# Altium project 724452_RPL-HX_Mobile_AEP_Rev0p91.PrjPcb (part 7 of 13)

## Sheet 0045_PCH STRAPS 1.SchDoc
size A3
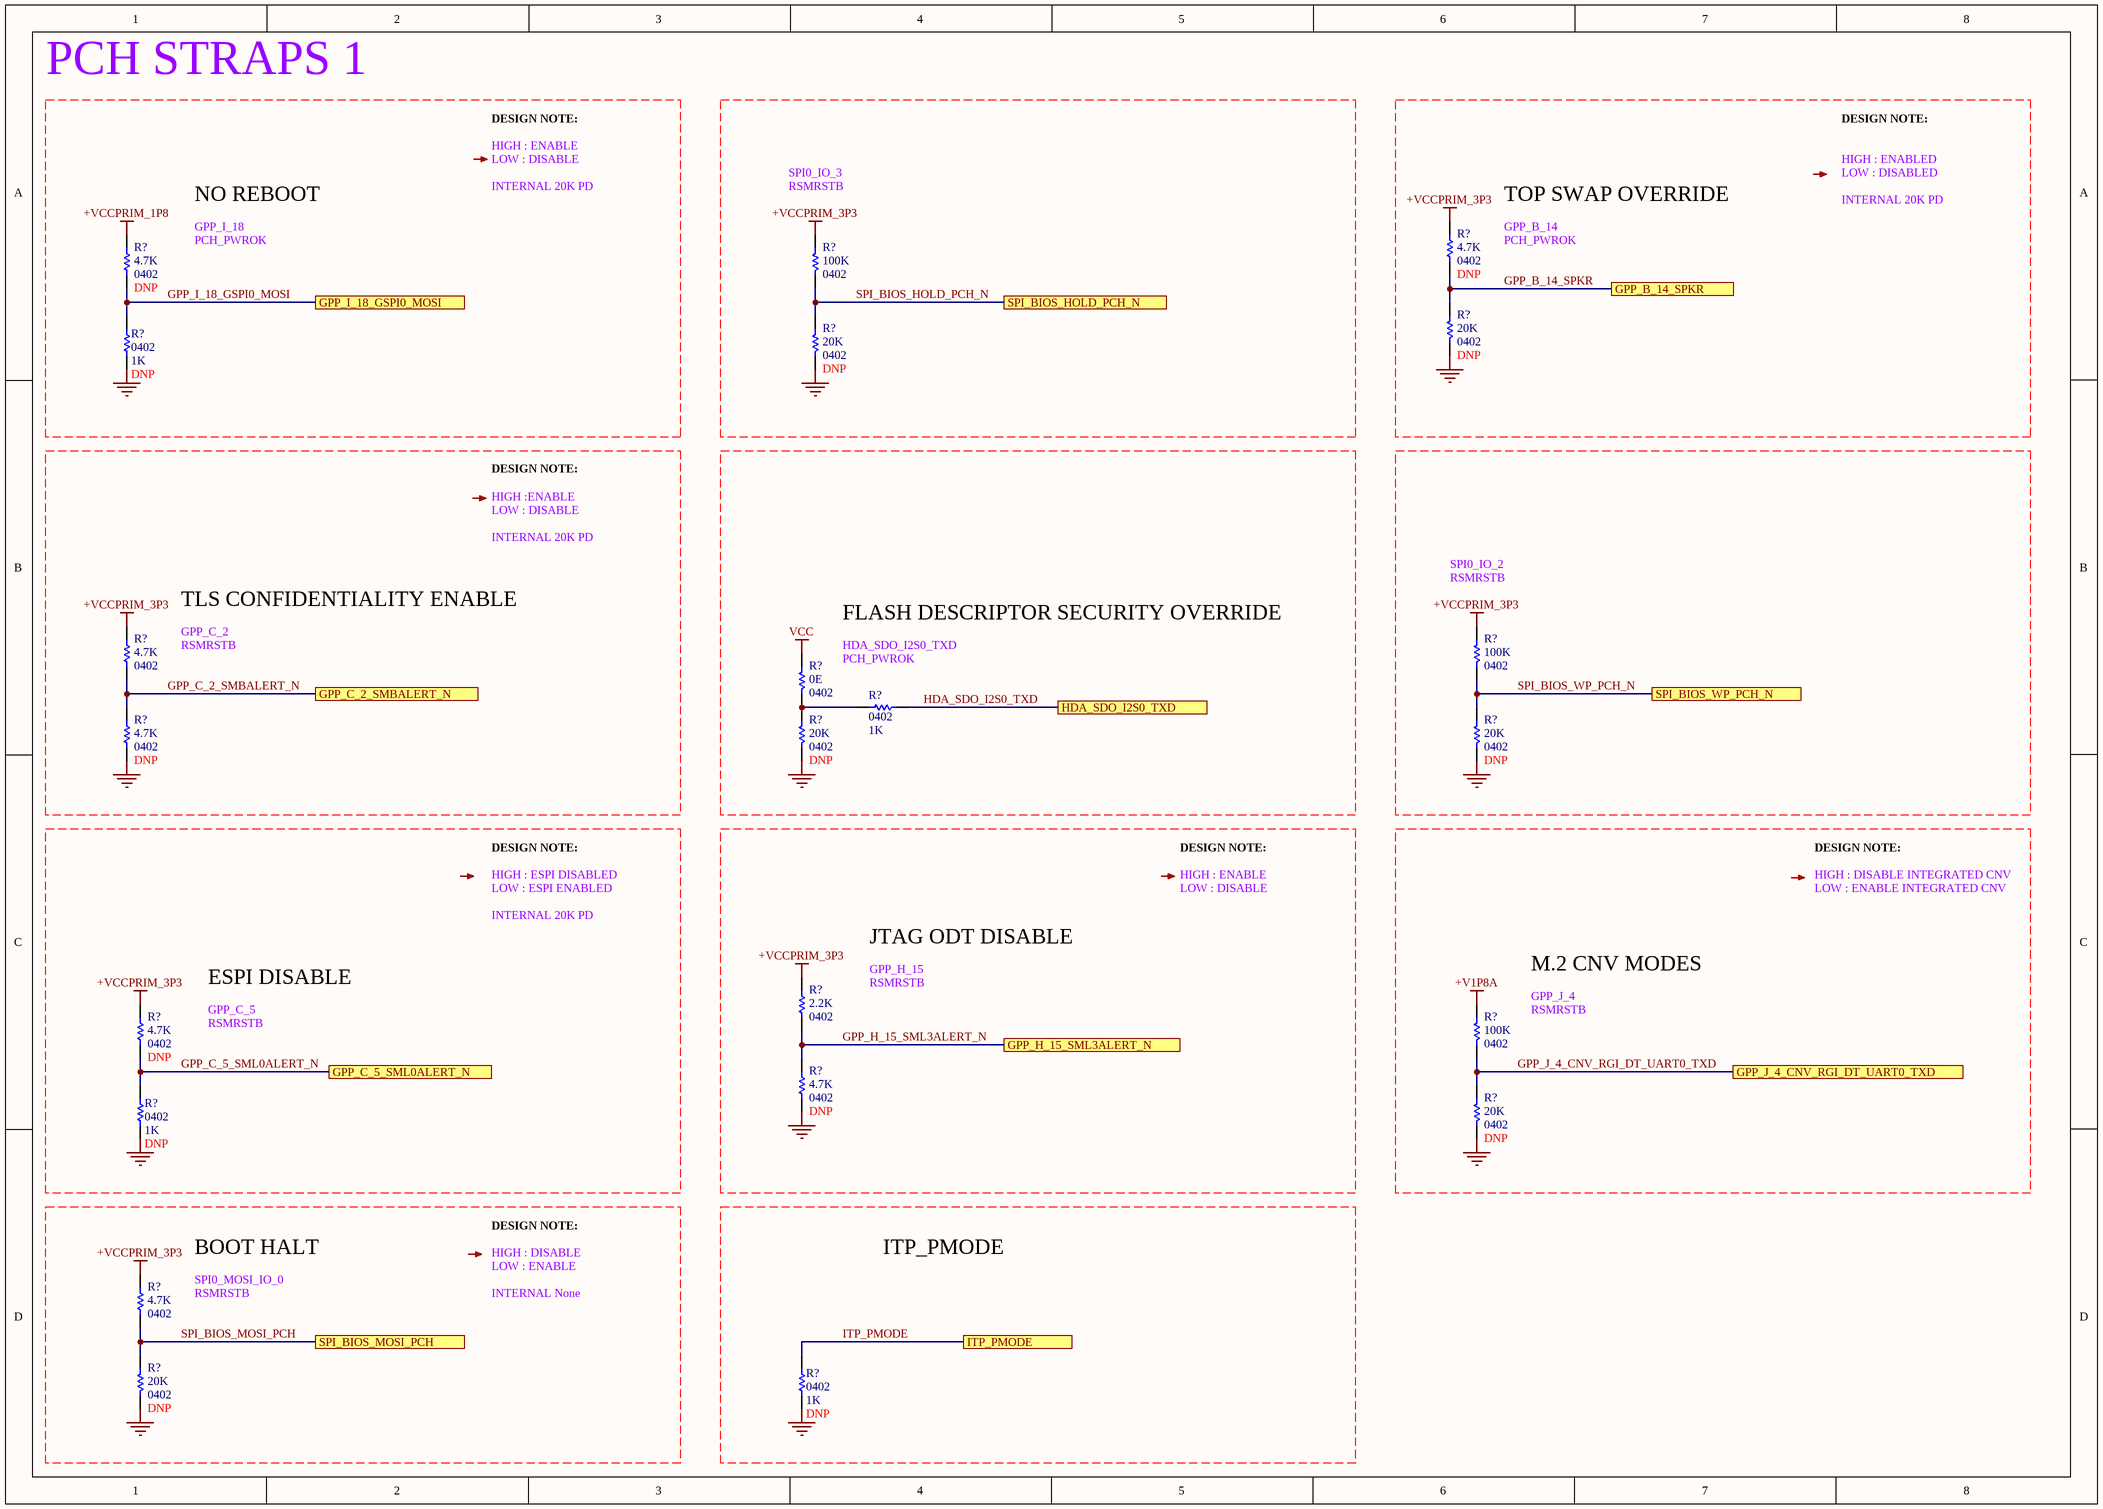
[diagram p76: 0045_PCH STRAPS 1.SchDoc]

### Parts
(Parts that share a designator on the sheet are numbered #1, #2 ... from top to bottom, then left to right.)
R?#184  value 4.7K  Case/Package: 0402  [RESC0402]  (hidden comment: Res)
R?#185  value 4.7K  Case/Package: 0402  [RESC0402]  (hidden comment: Res)
R?#186  value 100K  Case/Package: 0402  [RESC0402]  (hidden comment: Res)
R?#187  value 20K  Case/Package: 0402  [RESC0402]  (hidden comment: Res)
R?#188  value 1K  Case/Package: 0402  [RESC0402]  (hidden comment: Res)
R?#189  value 20K  Case/Package: 0402  [RESC0402]  (hidden comment: Res)
R?#190  value 4.7K  Case/Package: 0402  [RESC0402]  (hidden comment: Res)
R?#191  value 100K  Case/Package: 0402  [RESC0402]  (hidden comment: Res)
R?#192  value 0E  Case/Package: 0402  [RESC0402]  (hidden comment: Res)
R?#193  value 1K  Case/Package: 0402  [RESC0402]  (hidden comment: Res)
R?#194  value 4.7K  Case/Package: 0402  [RESC0402]  (hidden comment: Res)
R?#195  value 20K  Case/Package: 0402  [RESC0402]  (hidden comment: Res)
R?#196  value 20K  Case/Package: 0402  [RESC0402]  (hidden comment: Res)
R?#197  value 2.2K  Case/Package: 0402  [RESC0402]  (hidden comment: Res)
R?#198  value 4.7K  Case/Package: 0402  [RESC0402]  (hidden comment: Res)
R?#199  value 100K  Case/Package: 0402  [RESC0402]  (hidden comment: Res)
R?#200  value 4.7K  Case/Package: 0402  [RESC0402]  (hidden comment: Res)
R?#201  value 1K  Case/Package: 0402  [RESC0402]  (hidden comment: Res)
R?#202  value 20K  Case/Package: 0402  [RESC0402]  (hidden comment: Res)
R?#203  value 4.7K  Case/Package: 0402  [RESC0402]  (hidden comment: Res)
R?#204  value 20K  Case/Package: 0402  [RESC0402]  (hidden comment: Res)
R?#205  value 1K  Case/Package: 0402  [RESC0402]  (hidden comment: Res)

### Ports
GPP_B_14_SPKR, GPP_C_2_SMBALERT_N, GPP_C_5_SML0ALERT_N, GPP_H_15_SML3ALERT_N, GPP_I_18_GSPI0_MOSI, GPP_J_4_CNV_RGI_DT_UART0_TXD, HDA_SDO_I2S0_TXD, ITP_PMODE, SPI_BIOS_HOLD_PCH_N, SPI_BIOS_MOSI_PCH, SPI_BIOS_WP_PCH_N

### Nets
+V1P8A: R?#199.2
+VCCPRIM_1P8: R?#185.2
+VCCPRIM_3P3: R?#184.2 R?#186.2 R?#190.2 R?#191.2 R?#197.2 R?#198.2 R?#203.2
GND: R?#187.1 R?#188.1 R?#189.1 R?#194.1 R?#195.1 R?#196.1 R?#200.1 R?#201.1 R?#202.1 R?#204.1 R?#205.1  [project net EXP_A_RX_4_DP]
VCC: R?#192.2
GPP_B_14_SPKR: R?#184.1 R?#187.2 ; port GPP_B_14_SPKR
GPP_C_2_SMBALERT_N: R?#190.1 R?#194.2 ; port GPP_C_2_SMBALERT_N
GPP_C_5_SML0ALERT_N: R?#198.1 R?#201.2 ; port GPP_C_5_SML0ALERT_N
GPP_H_15_SML3ALERT_N: R?#197.1 R?#200.2 ; port GPP_H_15_SML3ALERT_N
GPP_I_18_GSPI0_MOSI: R?#185.1 R?#188.2 ; port GPP_I_18_GSPI0_MOSI
GPP_J_4_CNV_RGI_DT_UART0_TXD: R?#199.1 R?#202.2 ; port GPP_J_4_CNV_RGI_DT_UART0_TXD
HDA_SDO_I2S0_TXD: R?#193.2 ; port HDA_SDO_I2S0_TXD
ITP_PMODE: R?#205.2 ; port ITP_PMODE
SPI_BIOS_HOLD_PCH_N: R?#186.1 R?#189.2 ; port SPI_BIOS_HOLD_PCH_N
SPI_BIOS_MOSI_PCH: R?#203.1 R?#204.2 ; port SPI_BIOS_MOSI_PCH
SPI_BIOS_WP_PCH_N: R?#191.1 R?#196.2 ; port SPI_BIOS_WP_PCH_N
NetR?#192_1: R?#192.1 R?#193.1 R?#195.2

### Notes on the sheet
- PCH STRAPS 1
- DESIGN NOTE:
- LOW : DISABLE
- HIGH : ENABLE
- SPI0_IO_3
- LOW : DISABLED
- HIGH : ENABLED
- NO REBOOT
- GPP_I_18
- PCH_PWROK
- INTERNAL 20K PD
- RSMRSTB
- GPP_B_14
- TOP SWAP OVERRIDE
- HIGH :ENABLE
- SPI0_IO_2
- TLS CONFIDENTIALITY ENABLE
- GPP_C_2
- FLASH DESCRIPTOR SECURITY OVERRIDE
- (near R?#192) HDA_SDO_I2S0_TXD
- (near R?#193) PCH_PWROK
- HIGH : ESPI DISABLED
- LOW : ESPI ENABLED
- LOW : ENABLE INTEGRATED CNV
- HIGH : DISABLE INTEGRATED CNV
- ESPI DISABLE
- JTAG ODT DISABLE
- GPP_H_15
- M.2 CNV MODES
- GPP_C_5
- GPP_J_4
- BOOT HALT
- HIGH : DISABLE
- ITP_PMODE
- SPI0_MOSI_IO_0
- LOW : ENABLE
- INTERNAL None

### Library data of the parts
R?#184 R?#185 R?#190 R?#194 R?#198 R?#200 R?#203 = Res: Thick Film Resistor -  4.7Kohm, 1%, 0402
  R?#184 R?#185 R?#194 R?#198 R?#200: DNP: DNP
R?#186 R?#191 R?#199 = Res: Thick Film Resistor -  100Kohm, 1%, 0402
R?#187 R?#189 R?#195 R?#196 R?#202 R?#204 = Res: Thick Film Resistor -  20Kohm, 1%, 0402; DNP: DNP
R?#188 R?#193 R?#201 R?#205 = Res: Thick Film Resistor -  1Kohm, 1%, 0402
  R?#188 R?#201 R?#205: DNP: DNP
R?#192 = Res: Thick Film Resistor -  0ohm, 1%, 0402
R?#197 = Res: Thick Film Resistor -  2.2Kohm, 1%, 0402

## Sheet 0046_PCH STRAPS 2.SchDoc
size A3
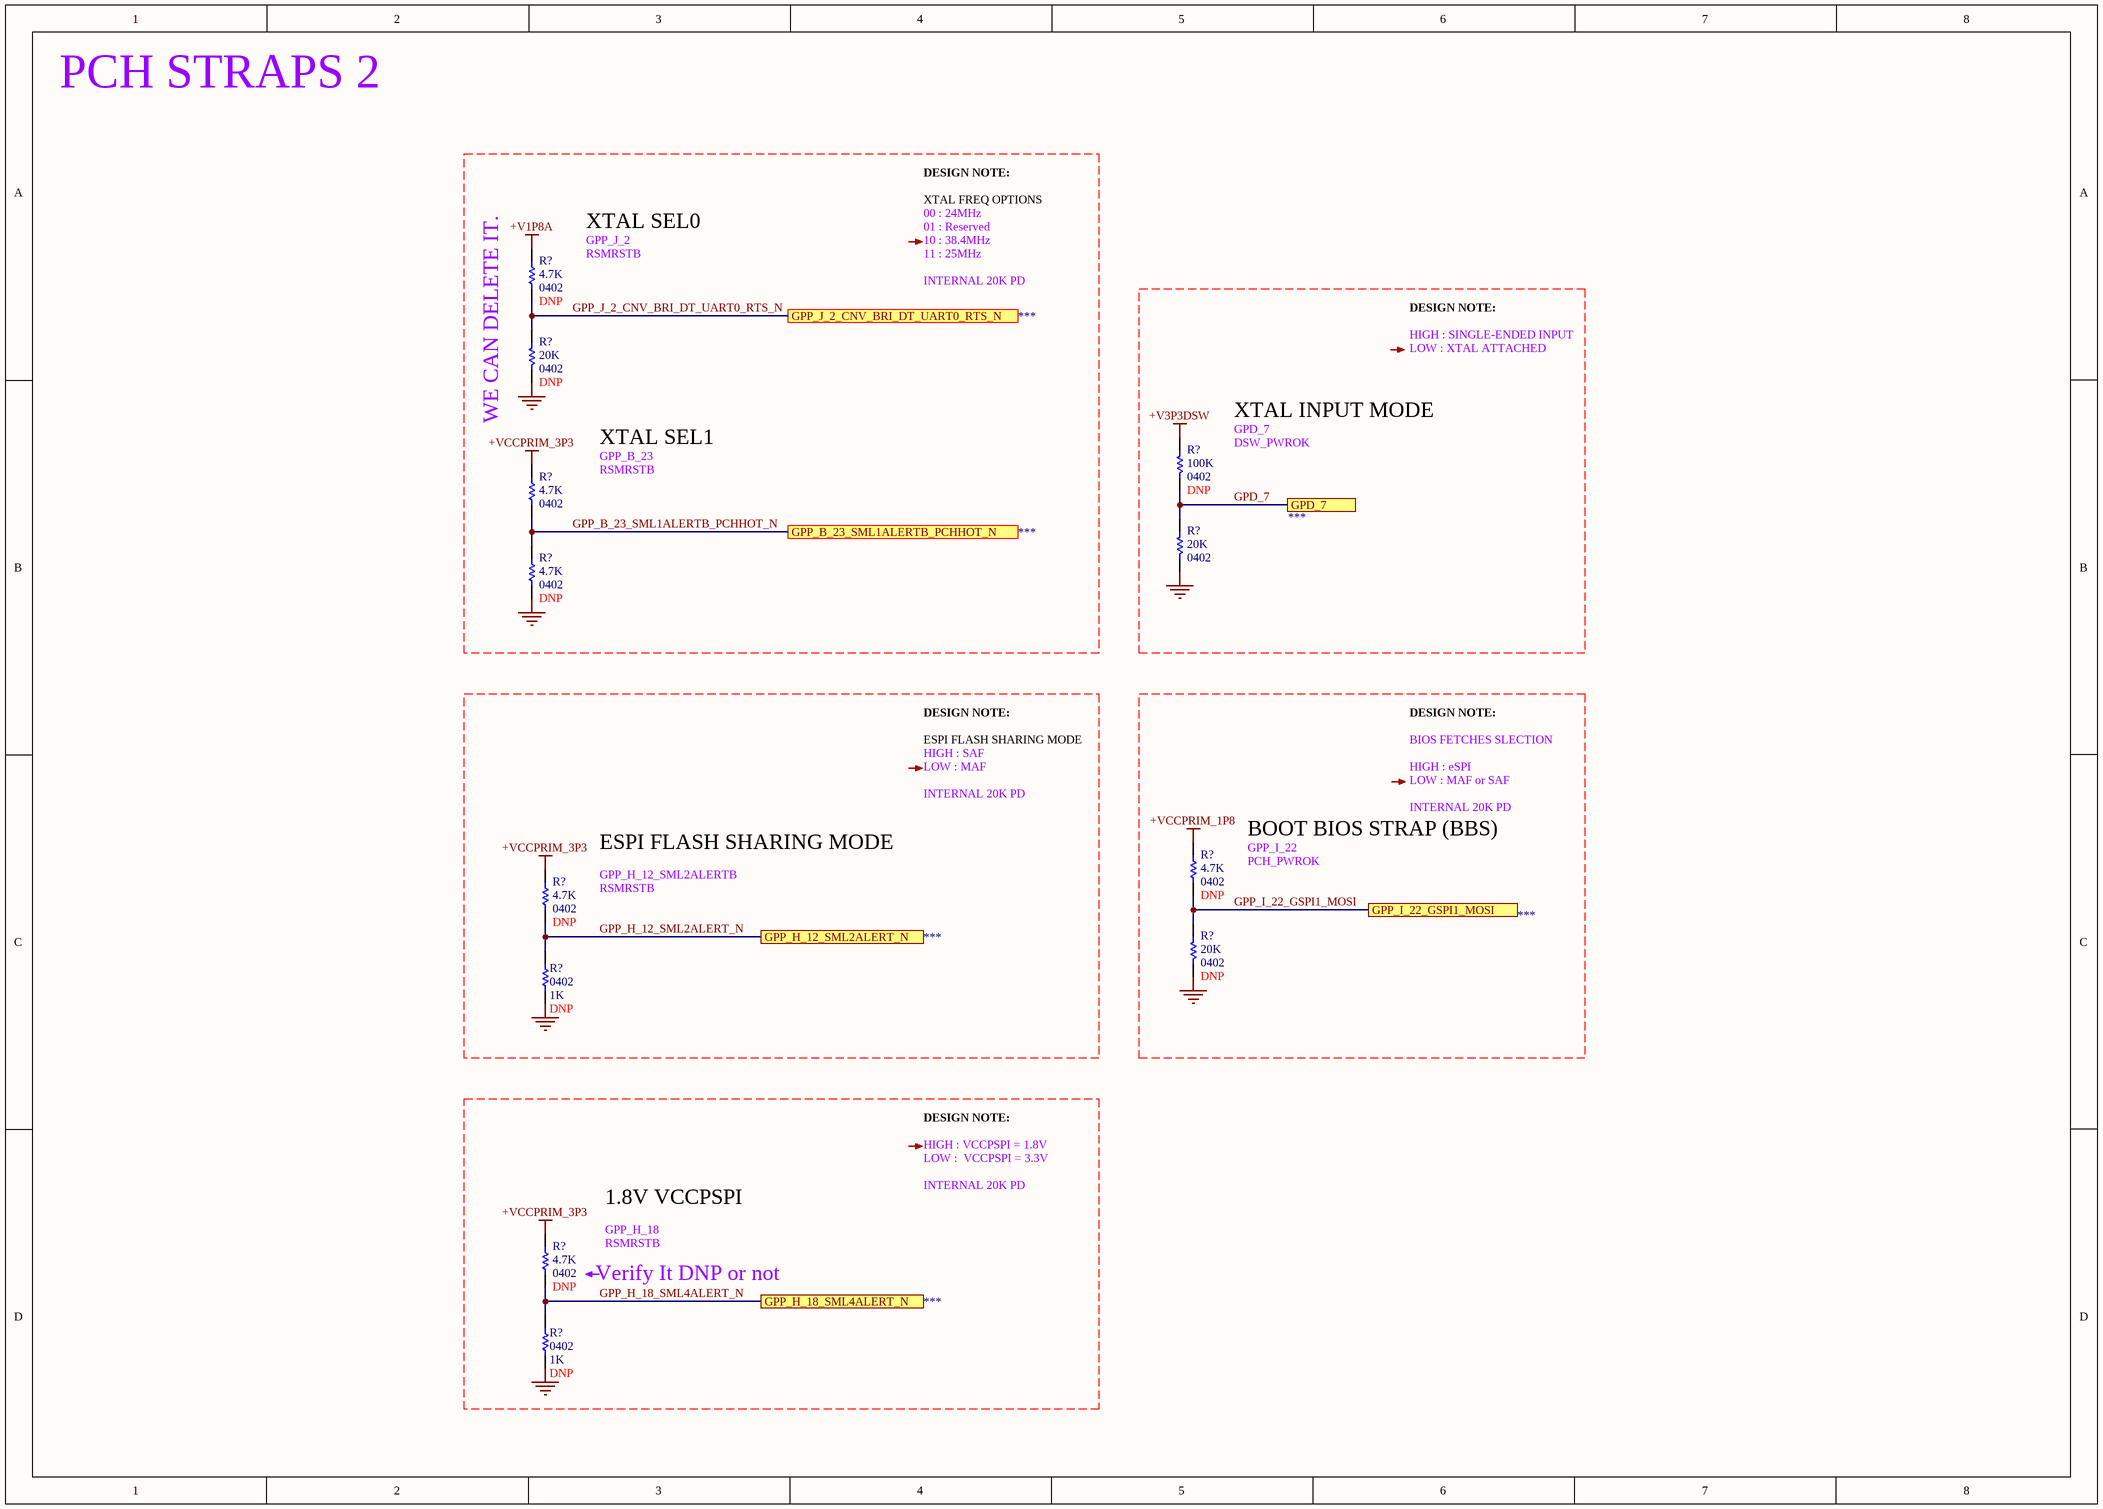
[diagram p77: 0046_PCH STRAPS 2.SchDoc]

### Parts
(Parts that share a designator on the sheet are numbered #1, #2 ... from top to bottom, then left to right.)
R?#206  value 4.7K  Case/Package: 0402  [RESC0402]  (hidden comment: Res)
R?#207  value 20K  Case/Package: 0402  [RESC0402]  (hidden comment: Res)
R?#208  value 100K  Case/Package: 0402  [RESC0402]  (hidden comment: Res)
R?#209  value 4.7K  Case/Package: 0402  [RESC0402]  (hidden comment: Res)
R?#210  value 20K  Case/Package: 0402  [RESC0402]  (hidden comment: Res)
R?#211  value 4.7K  Case/Package: 0402  [RESC0402]  (hidden comment: Res)
R?#212  value 4.7K  Case/Package: 0402  [RESC0402]  (hidden comment: Res)
R?#213  value 4.7K  Case/Package: 0402  [RESC0402]  (hidden comment: Res)
R?#214  value 20K  Case/Package: 0402  [RESC0402]  (hidden comment: Res)
R?#215  value 1K  Case/Package: 0402  [RESC0402]  (hidden comment: Res)
R?#216  value 4.7K  Case/Package: 0402  [RESC0402]  (hidden comment: Res)
R?#217  value 1K  Case/Package: 0402  [RESC0402]  (hidden comment: Res)

### Ports
GPD_7, GPP_B_23_SML1ALERTB_PCHHOT_N, GPP_H_12_SML2ALERT_N, GPP_H_18_SML4ALERT_N, GPP_I_22_GSPI1_MOSI, GPP_J_2_CNV_BRI_DT_UART0_RTS_N

### Nets
+V1P8A: R?#206.2
+V3P3DSW: R?#208.2
+VCCPRIM_1P8: R?#212.2
+VCCPRIM_3P3: R?#209.2 R?#213.2 R?#216.2
GND: R?#207.1 R?#210.1 R?#211.1 R?#214.1 R?#215.1 R?#217.1  [project net EXP_A_RX_4_DP]
GPD_7: R?#208.1 R?#210.2 ; port GPD_7
GPP_B_23_SML1ALERTB_PCHHOT_N: R?#209.1 R?#211.2 ; port GPP_B_23_SML1ALERTB_PCHHOT_N
GPP_H_12_SML2ALERT_N: R?#213.1 R?#215.2 ; port GPP_H_12_SML2ALERT_N
GPP_H_18_SML4ALERT_N: R?#216.1 R?#217.2 ; port GPP_H_18_SML4ALERT_N
GPP_I_22_GSPI1_MOSI: R?#212.1 R?#214.2 ; port GPP_I_22_GSPI1_MOSI
GPP_J_2_CNV_BRI_DT_UART0_RTS_N: R?#206.1 R?#207.2 ; port GPP_J_2_CNV_BRI_DT_UART0_RTS_N

### Notes on the sheet
- PCH STRAPS 2
- DESIGN NOTE:
- GPP_J_2
- XTAL SEL0
- XTAL FREQ OPTIONS
- 10 : 38.4MHz
- 00 : 24MHz
- 01 : Reserved
- RSMRSTB
- INTERNAL 20K PD
- 11 : 25MHz
- LOW : XTAL ATTACHED
- HIGH : SINGLE-ENDED INPUT
- (near R?#206) WE CAN DELETE IT.
- XTAL SEL1
- DSW_PWROK
- GPD_7
- XTAL INPUT MODE
- GPP_B_23
- HIGH : SAF
- LOW : MAF
- ESPI FLASH SHARING MODE
- LOW : MAF or SAF
- BIOS FETCHES SLECTION
- HIGH : eSPI
- BOOT BIOS STRAP (BBS)
- GPP_I_22
- GPP_H_12_SML2ALERTB
- PCH_PWROK
- HIGH : VCCPSPI = 1.8V
- LOW :  VCCPSPI = 3.3V
- GPP_H_18
- 1.8V VCCPSPI
- (near R?#216) Verify It DNP or not

### Library data of the parts
R?#206 R?#209 R?#211-R?#213 R?#216 = Res: Thick Film Resistor -  4.7Kohm, 1%, 0402
  R?#206 R?#211-R?#213 R?#216: DNP: DNP
R?#207 R?#210 R?#214 = Res: Thick Film Resistor -  20Kohm, 1%, 0402
  R?#207 R?#214: DNP: DNP
R?#208 = Res: Thick Film Resistor -  100Kohm, 1%, 0402; DNP: DNP
R?#215 R?#217 = Res: Thick Film Resistor -  1Kohm, 1%, 0402; DNP: DNP

## Sheet 0047_PCH VALIDATION.SchDoc
size A3
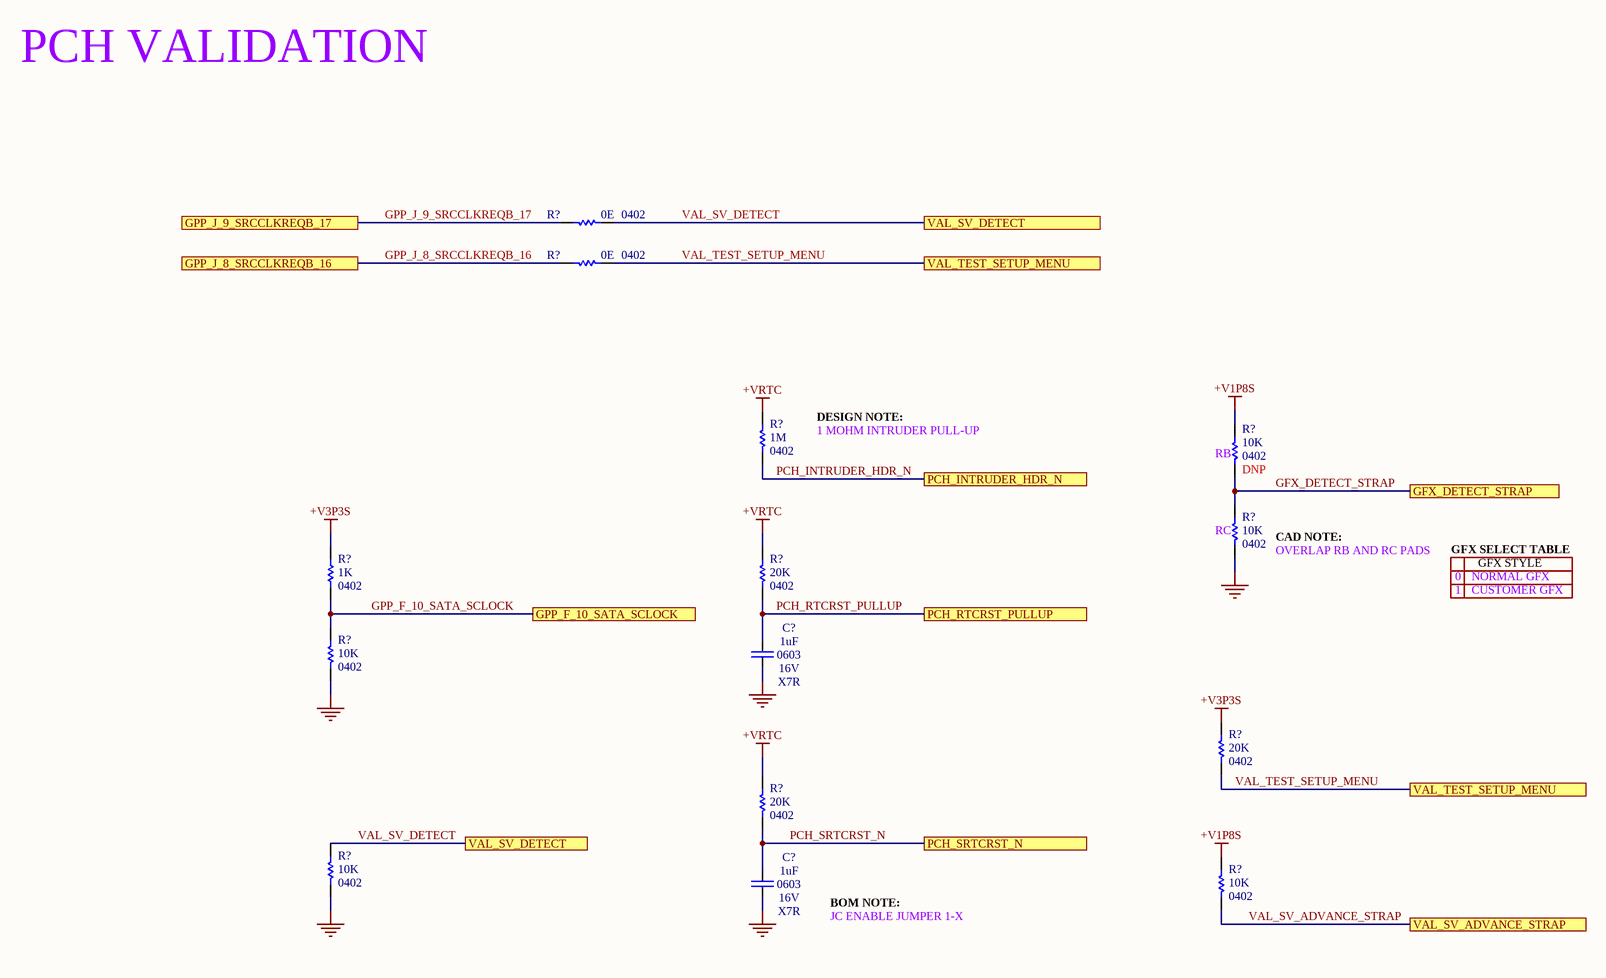
[diagram p78: 0047_PCH VALIDATION.SchDoc]

### Parts
(Parts that share a designator on the sheet are numbered #1, #2 ... from top to bottom, then left to right.)
C?#101  value 1uF  Case/Package: 0603  Voltage: 16V  Dielectric: X7R  [CAPC0603]
C?#102  value 1uF  Case/Package: 0603  Voltage: 16V  Dielectric: X7R  [CAPC0603]
R?#218  value 0E  Case/Package: 0402  [RESC0402]  (hidden comment: Res)
R?#219  value 0E  Case/Package: 0402  [RESC0402]  (hidden comment: Res)
R?#220  value 1M  Case/Package: 0402  [RESC0402]  (hidden comment: Res)
R?#221  value 10K  Case/Package: 0402  [RESC0402]  (hidden comment: Res)
R?#222  value 10K  Case/Package: 0402  [RESC0402]  (hidden comment: Res)
R?#223  value 1K  Case/Package: 0402  [RESC0402]  (hidden comment: Res)
R?#224  value 20K  Case/Package: 0402  [RESC0402]  (hidden comment: Res)
R?#225  value 10K  Case/Package: 0402  [RESC0402]  (hidden comment: Res)
R?#226  value 20K  Case/Package: 0402  [RESC0402]  (hidden comment: Res)
R?#227  value 20K  Case/Package: 0402  [RESC0402]  (hidden comment: Res)
R?#228  value 10K  Case/Package: 0402  [RESC0402]  (hidden comment: Res)
R?#229  value 10K  Case/Package: 0402  [RESC0402]  (hidden comment: Res)

### Ports
GFX_DETECT_STRAP, GPP_F_10_SATA_SCLOCK, GPP_J_8_SRCCLKREQB_16, GPP_J_9_SRCCLKREQB_17, PCH_INTRUDER_HDR_N, PCH_RTCRST_PULLUP, PCH_SRTCRST_N, VAL_SV_ADVANCE_STRAP, VAL_SV_DETECT, VAL_TEST_SETUP_MENU

### Nets
+V1P8S: R?#221.2 R?#229.2
+V3P3S: R?#223.2 R?#226.2
+VRTC: R?#220.2 R?#224.2 R?#227.2
GND: C?#101.1 C?#102.1 R?#222.1 R?#225.1 R?#228.1  [project net EXP_A_RX_4_DP]
GFX_DETECT_STRAP: R?#221.1 R?#222.2 ; port GFX_DETECT_STRAP
GPP_F_10_SATA_SCLOCK: R?#223.1 R?#225.2 ; port GPP_F_10_SATA_SCLOCK
GPP_J_8_SRCCLKREQB_16: R?#219.1 ; port GPP_J_8_SRCCLKREQB_16
GPP_J_9_SRCCLKREQB_17: R?#218.1 ; port GPP_J_9_SRCCLKREQB_17
PCH_INTRUDER_HDR_N: R?#220.1 ; port PCH_INTRUDER_HDR_N
PCH_RTCRST_PULLUP: C?#101.2 R?#224.1 ; port PCH_RTCRST_PULLUP
PCH_SRTCRST_N: C?#102.2 R?#227.1 ; port PCH_SRTCRST_N
VAL_SV_ADVANCE_STRAP: R?#229.1 ; port VAL_SV_ADVANCE_STRAP
VAL_SV_DETECT: R?#218.2 R?#228.2 ; port VAL_SV_DETECT
VAL_TEST_SETUP_MENU: R?#219.2 R?#226.1 ; port VAL_TEST_SETUP_MENU

### Notes on the sheet
- PCH VALIDATION
- DESIGN NOTE:
- 1 MOHM INTRUDER PULL-UP
- (near R?#221) RB
- (near R?#222) RC
- (near R?#222) CAD NOTE:
- (near R?#222) OVERLAP RB AND RC PADS
- GFX SELECT TABLE
- 0
- 1
- NORMAL GFX
- CUSTOMER GFX
- GFX STYLE
- BOM NOTE:
- JC ENABLE JUMPER 1-X

### Library data of the parts
C?#101 C?#102 = Cap: CAP CER 1uF 16V X7R 0603
R?#218 R?#219 = Res: Thick Film Resistor -  0ohm, 1%, 0402
R?#220 = Res: Thick Film Resistor -  1Mohm, 1%, 0402
R?#221 R?#222 R?#225 R?#228 R?#229 = Res: Thick Film Resistor -  10Kohm, 1%, 0402
  R?#221: DNP: DNP
R?#223 = Res: Thick Film Resistor -  1Kohm, 1%, 0402
R?#224 R?#226 R?#227 = Res: Thick Film Resistor -  20Kohm, 1%, 0402

## Sheet 0049_GLITCH FREE CIRCUI.SchDoc
size A3
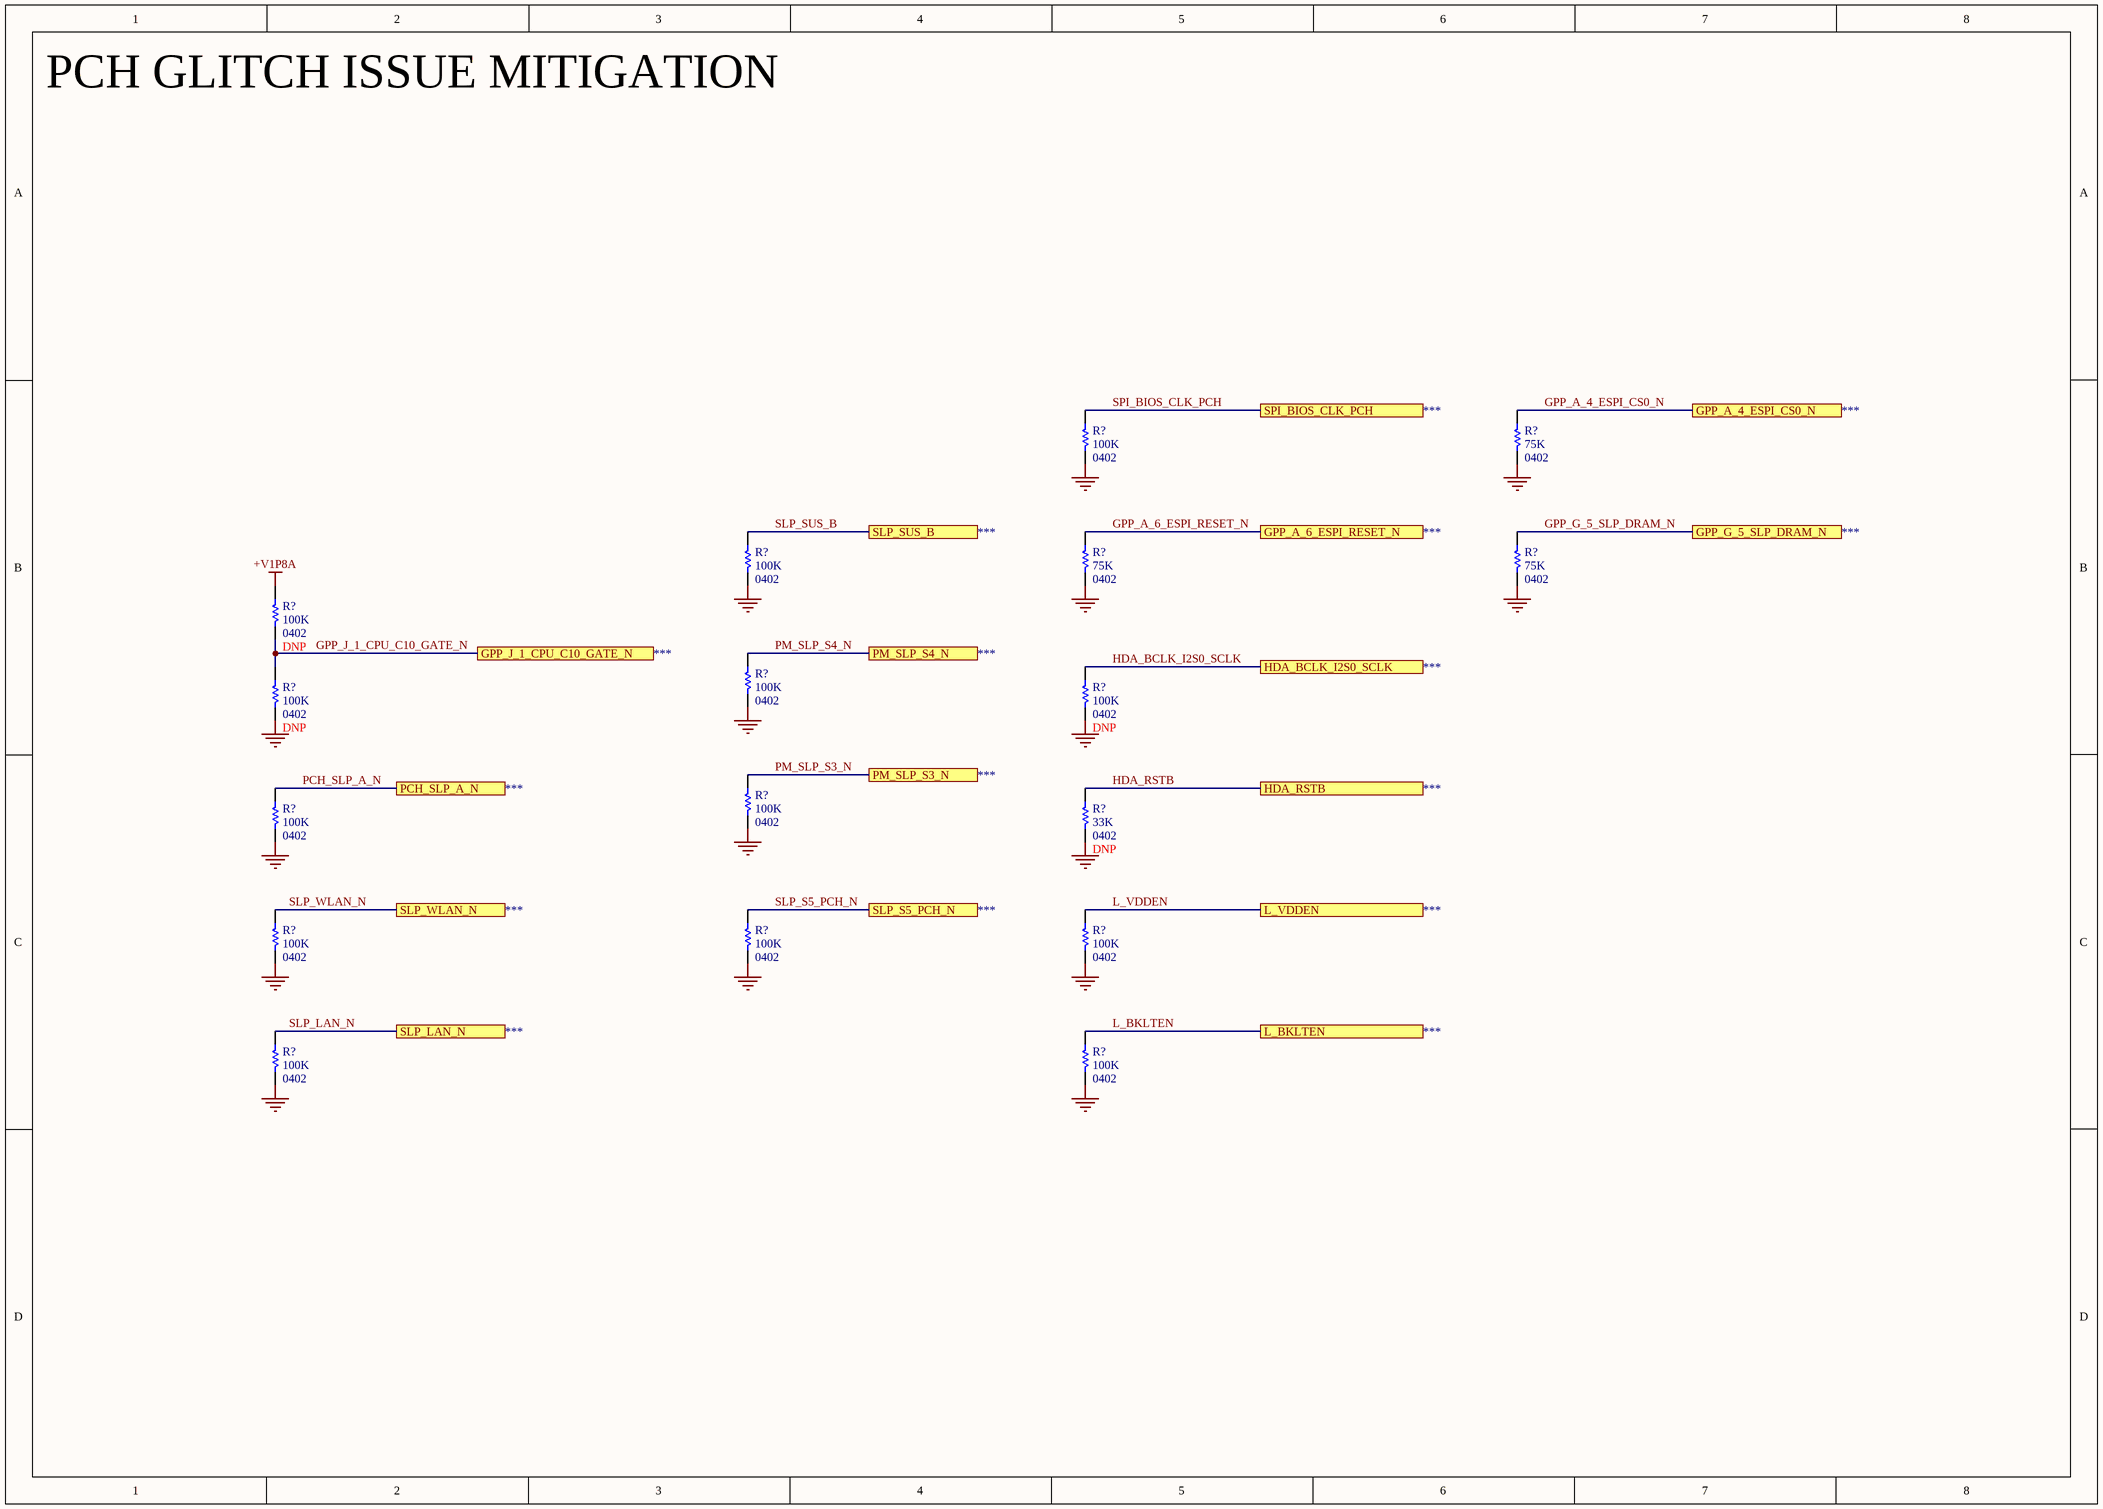
[diagram p79: 0049_GLITCH FREE CIRCUI.SchDoc]

### Parts
(Parts that share a designator on the sheet are numbered #1, #2 ... from top to bottom, then left to right.)
R?#230  value 100K  Case/Package: 0402  [RESC0402]  (hidden comment: Res)
R?#231  value 75K  Case/Package: 0402  [RESC0402]  (hidden comment: Res)
R?#232  value 100K  Case/Package: 0402  [RESC0402]  (hidden comment: Res)
R?#233  value 75K  Case/Package: 0402  [RESC0402]  (hidden comment: Res)
R?#234  value 75K  Case/Package: 0402  [RESC0402]  (hidden comment: Res)
R?#235  value 100K  Case/Package: 0402  [RESC0402]  (hidden comment: Res)
R?#236  value 100K  Case/Package: 0402  [RESC0402]  (hidden comment: Res)
R?#237  value 100K  Case/Package: 0402  [RESC0402]  (hidden comment: Res)
R?#238  value 100K  Case/Package: 0402  [RESC0402]  (hidden comment: Res)
R?#239  value 100K  Case/Package: 0402  [RESC0402]  (hidden comment: Res)
R?#240  value 100K  Case/Package: 0402  [RESC0402]  (hidden comment: Res)
R?#241  value 33K  Case/Package: 0402  [RESC0402]  (hidden comment: Res)
R?#242  value 100K  Case/Package: 0402  [RESC0402]  (hidden comment: Res)
R?#243  value 100K  Case/Package: 0402  [RESC0402]  (hidden comment: Res)
R?#244  value 100K  Case/Package: 0402  [RESC0402]  (hidden comment: Res)
R?#245  value 100K  Case/Package: 0402  [RESC0402]  (hidden comment: Res)
R?#246  value 100K  Case/Package: 0402  [RESC0402]  (hidden comment: Res)

### Ports
GPP_A_4_ESPI_CS0_N, GPP_A_6_ESPI_RESET_N, GPP_G_5_SLP_DRAM_N, GPP_J_1_CPU_C10_GATE_N, HDA_BCLK_I2S0_SCLK, HDA_RSTB, L_BKLTEN, L_VDDEN, PCH_SLP_A_N, PM_SLP_S3_N, PM_SLP_S4_N, SLP_LAN_N, SLP_S5_PCH_N, SLP_SUS_B, SLP_WLAN_N, SPI_BIOS_CLK_PCH

### Nets
+V1P8A: R?#235.2
GND: R?#230.1 R?#231.1 R?#232.1 R?#233.1 R?#234.1 R?#236.1 R?#237.1 R?#238.1 R?#239.1 R?#240.1 R?#241.1 R?#242.1 R?#243.1 R?#244.1 R?#245.1 R?#246.1  [project net EXP_A_RX_4_DP]
GPP_A_4_ESPI_CS0_N: R?#231.2 ; port GPP_A_4_ESPI_CS0_N
GPP_A_6_ESPI_RESET_N: R?#233.2 ; port GPP_A_6_ESPI_RESET_N
GPP_G_5_SLP_DRAM_N: R?#234.2 ; port GPP_G_5_SLP_DRAM_N
GPP_J_1_CPU_C10_GATE_N: R?#235.1 R?#237.2 ; port GPP_J_1_CPU_C10_GATE_N
HDA_BCLK_I2S0_SCLK: R?#238.2 ; port HDA_BCLK_I2S0_SCLK
HDA_RSTB: R?#241.2 ; port HDA_RSTB
L_BKLTEN: R?#246.2 ; port L_BKLTEN
L_VDDEN: R?#244.2 ; port L_VDDEN
PCH_SLP_A_N: R?#240.2 ; port PCH_SLP_A_N
PM_SLP_S3_N: R?#239.2 ; port PM_SLP_S3_N
PM_SLP_S4_N: R?#236.2 ; port PM_SLP_S4_N
SLP_LAN_N: R?#245.2 ; port SLP_LAN_N
SLP_S5_PCH_N: R?#243.2 ; port SLP_S5_PCH_N
SLP_SUS_B: R?#232.2 ; port SLP_SUS_B
SLP_WLAN_N: R?#242.2 ; port SLP_WLAN_N
SPI_BIOS_CLK_PCH: R?#230.2 ; port SPI_BIOS_CLK_PCH

### Notes on the sheet
- PCH GLITCH ISSUE MITIGATION

### Library data of the parts
R?#230 R?#232 R?#235-R?#240 R?#242-R?#246 = Res: Thick Film Resistor -  100Kohm, 1%, 0402
  R?#235 R?#237 R?#238: DNP: DNP
R?#231 R?#233 R?#234 = Res: Thick Film Resistor -  75Kohm, 1%, 0402
R?#241 = Res: Thick Film Resistor -  33Kohm, 1%, 0402; DNP: DNP

## Sheet 0052_PCIe_X16.SchDoc
size A2
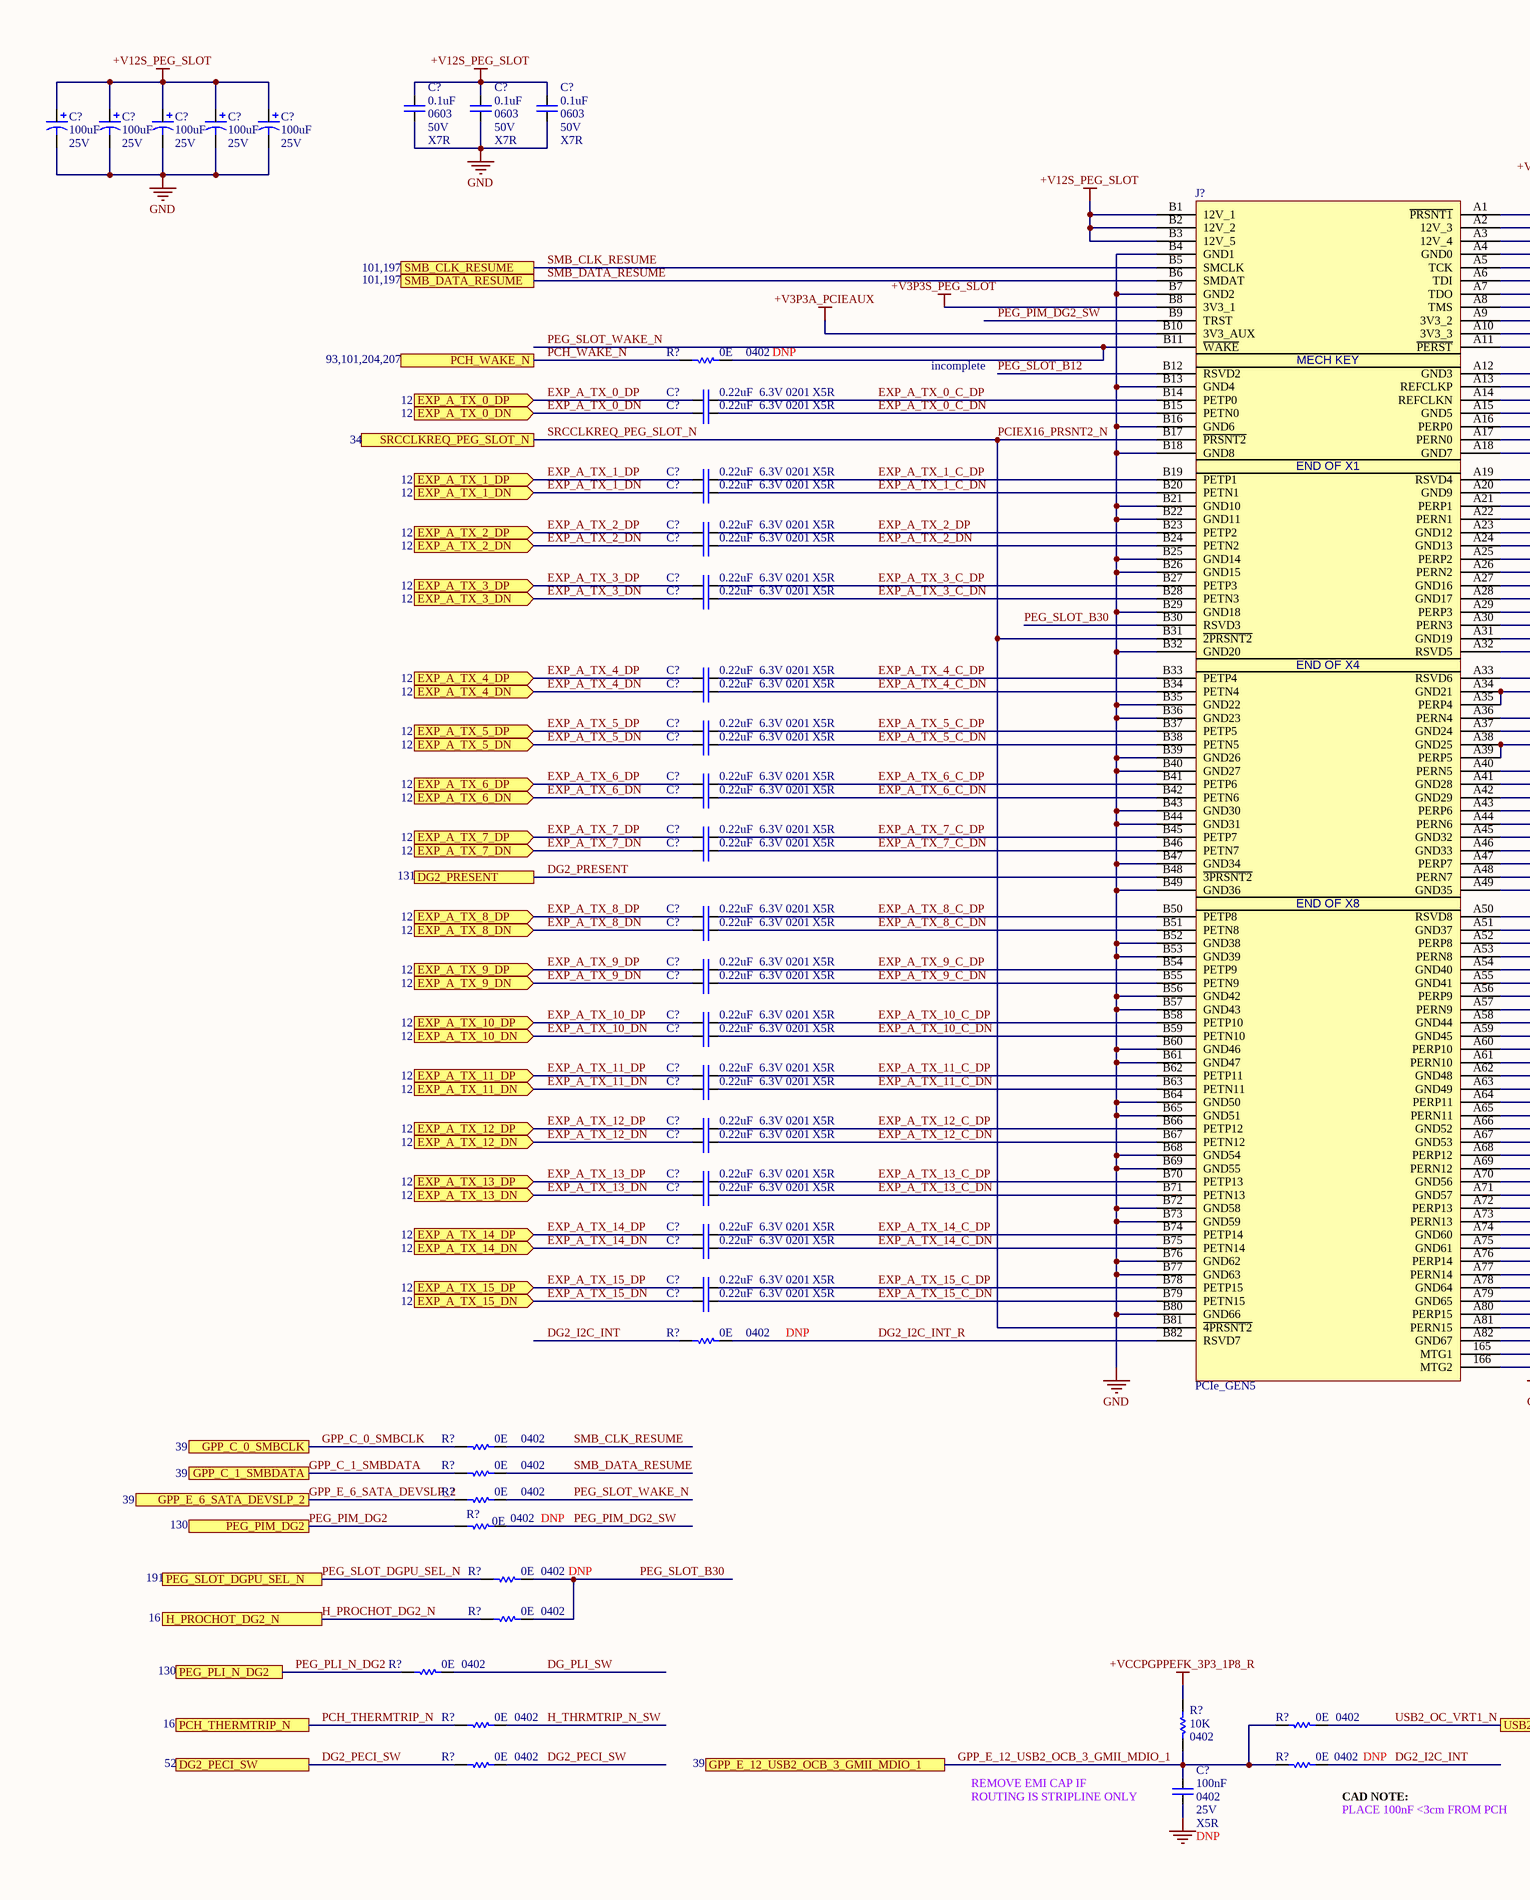
[diagram p80: 0052_PCIe_X16.SchDoc, left]
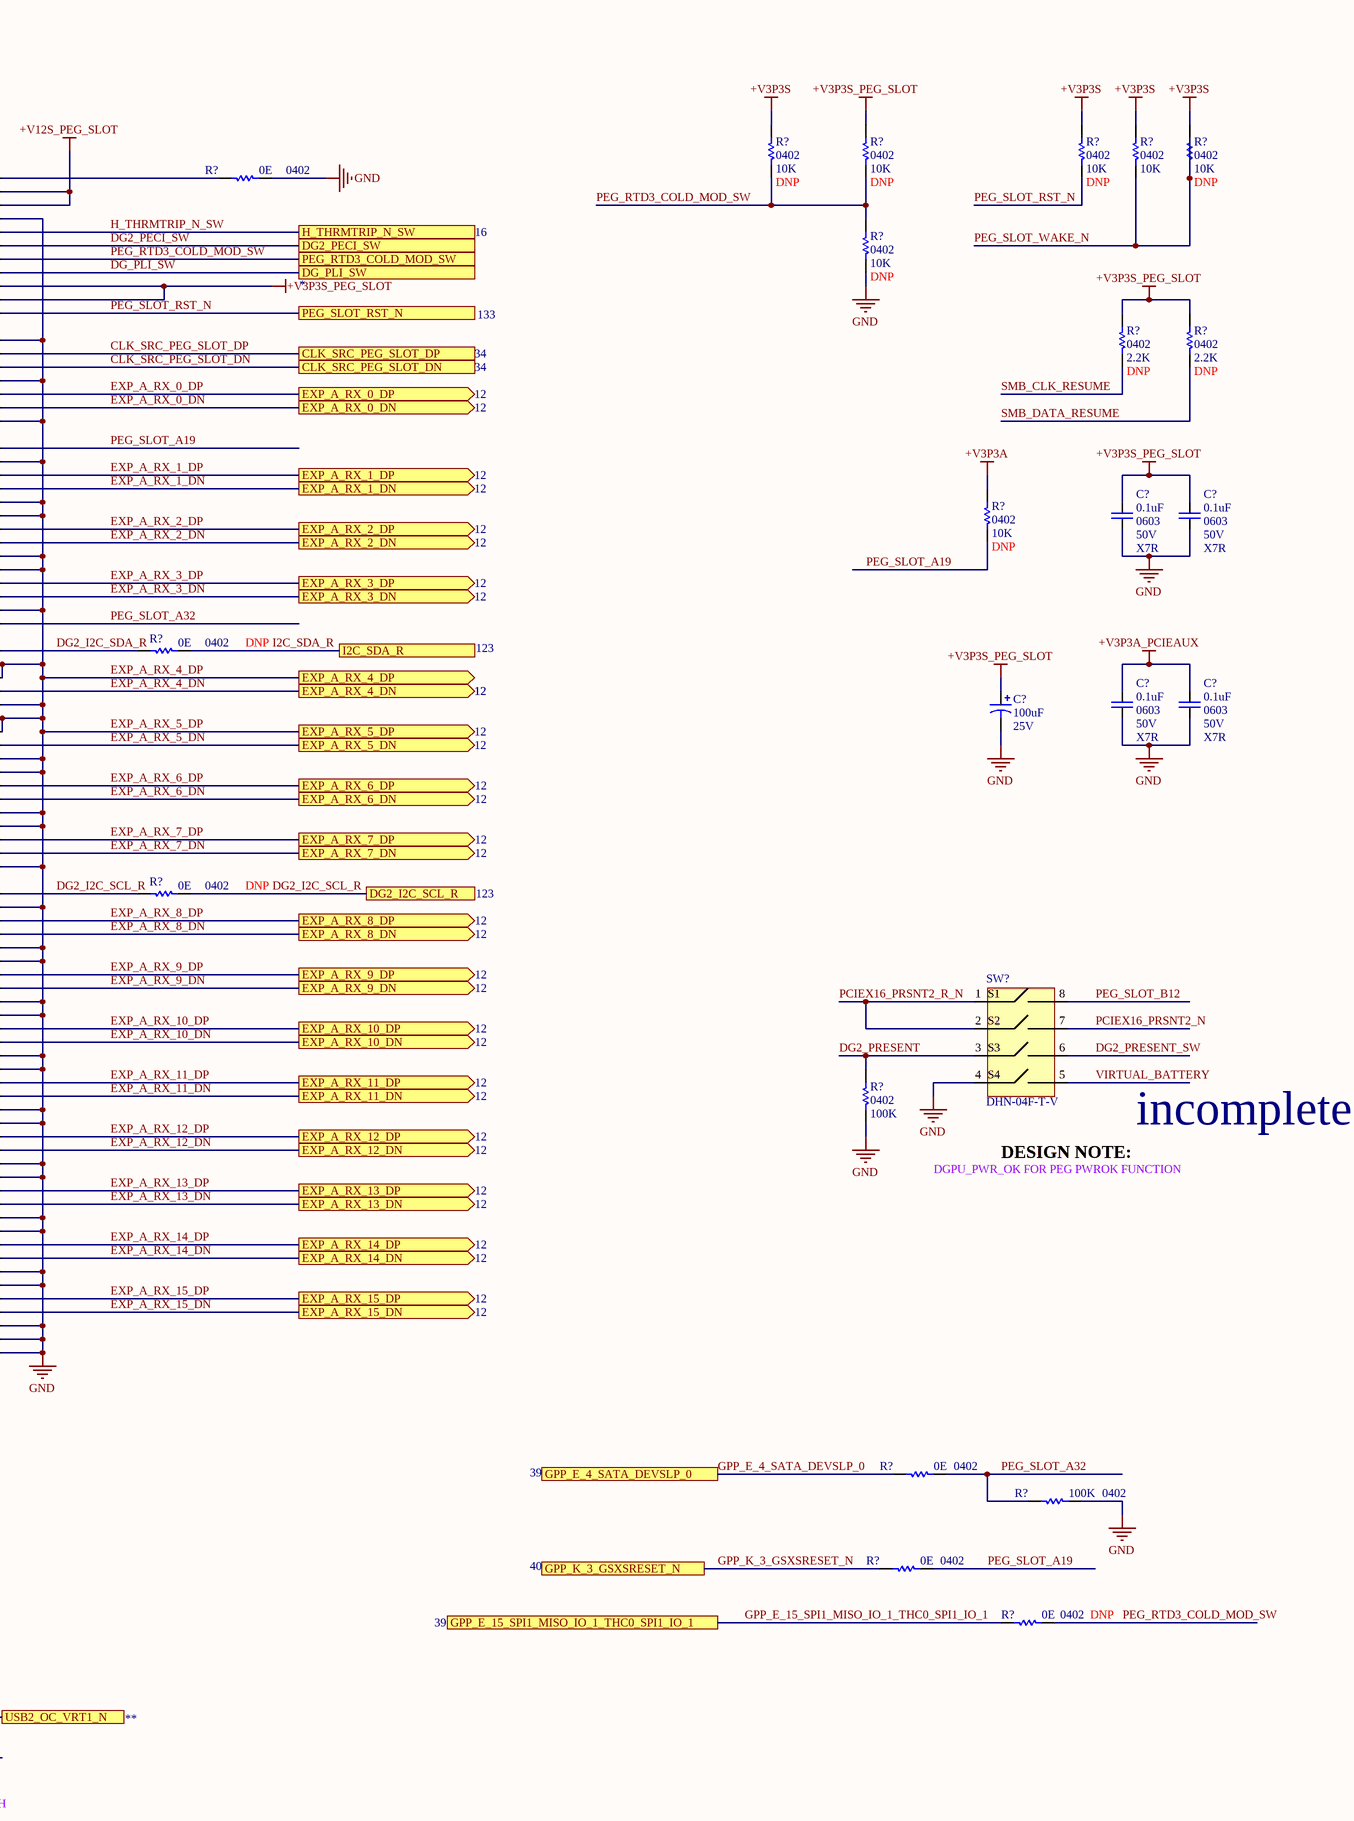
[diagram p81: 0052_PCIe_X16.SchDoc, right]

### Parts
(Parts that share a designator on the sheet are numbered #1, #2 ... from top to bottom, then left to right.)
C?#103  value 100uF  Voltage: 25V  (hidden comment: cap_polar)
C?#104  value 100uF  Voltage: 25V  (hidden comment: cap_polar)
C?#105  value 100uF  Voltage: 25V  (hidden comment: cap_polar)
C?#106  value 100uF  Voltage: 25V  (hidden comment: cap_polar)
C?#107  value 100uF  Voltage: 25V  (hidden comment: cap_polar)
C?#108  value 0.1uF  Case/Package: 0603  Voltage: 50V  Dielectric: X7R  [CAPC0201]
C?#109  value 0.1uF  Case/Package: 0603  Voltage: 50V  Dielectric: X7R  [CAPC0201]
C?#110  value 0.1uF  Case/Package: 0603  Voltage: 50V  Dielectric: X7R  [CAPC0201]
C?#111  value 0.22uF  Case/Package: 0201  Voltage: 6.3V  Dielectric: X5R  [CAPC0201]
C?#112  value 0.22uF  Case/Package: 0201  Voltage: 6.3V  Dielectric: X5R  [CAPC0201]
C?#113  value 0.22uF  Case/Package: 0201  Voltage: 6.3V  Dielectric: X5R  [CAPC0201]
C?#114  value 0.22uF  Case/Package: 0201  Voltage: 6.3V  Dielectric: X5R  [CAPC0201]
C?#115  value 0.22uF  Case/Package: 0201  Voltage: 6.3V  Dielectric: X5R  [CAPC0201]
C?#116  value 0.22uF  Case/Package: 0201  Voltage: 6.3V  Dielectric: X5R  [CAPC0201]
C?#117  value 0.1uF  Case/Package: 0603  Voltage: 50V  Dielectric: X7R  [CAPC0201]
C?#118  value 0.1uF  Case/Package: 0603  Voltage: 50V  Dielectric: X7R  [CAPC0201]
C?#119  value 0.22uF  Case/Package: 0201  Voltage: 6.3V  Dielectric: X5R  [CAPC0201]
C?#120  value 0.22uF  Case/Package: 0201  Voltage: 6.3V  Dielectric: X5R  [CAPC0201]
C?#121  value 0.22uF  Case/Package: 0201  Voltage: 6.3V  Dielectric: X5R  [CAPC0201]
C?#122  value 0.22uF  Case/Package: 0201  Voltage: 6.3V  Dielectric: X5R  [CAPC0201]
C?#123  value 100uF  Voltage: 25V  (hidden comment: cap_polar)
C?#124  value 0.22uF  Case/Package: 0201  Voltage: 6.3V  Dielectric: X5R  [CAPC0201]
C?#125  value 0.1uF  Case/Package: 0603  Voltage: 50V  Dielectric: X7R  [CAPC0201]
C?#126  value 0.1uF  Case/Package: 0603  Voltage: 50V  Dielectric: X7R  [CAPC0201]
C?#127  value 0.22uF  Case/Package: 0201  Voltage: 6.3V  Dielectric: X5R  [CAPC0201]
C?#128  value 0.22uF  Case/Package: 0201  Voltage: 6.3V  Dielectric: X5R  [CAPC0201]
C?#129  value 0.22uF  Case/Package: 0201  Voltage: 6.3V  Dielectric: X5R  [CAPC0201]
C?#130  value 0.22uF  Case/Package: 0201  Voltage: 6.3V  Dielectric: X5R  [CAPC0201]
C?#131  value 0.22uF  Case/Package: 0201  Voltage: 6.3V  Dielectric: X5R  [CAPC0201]
C?#132  value 0.22uF  Case/Package: 0201  Voltage: 6.3V  Dielectric: X5R  [CAPC0201]
C?#133  value 0.22uF  Case/Package: 0201  Voltage: 6.3V  Dielectric: X5R  [CAPC0201]
C?#134  value 0.22uF  Case/Package: 0201  Voltage: 6.3V  Dielectric: X5R  [CAPC0201]
C?#135  value 0.22uF  Case/Package: 0201  Voltage: 6.3V  Dielectric: X5R  [CAPC0201]
C?#136  value 0.22uF  Case/Package: 0201  Voltage: 6.3V  Dielectric: X5R  [CAPC0201]
C?#137  value 0.22uF  Case/Package: 0201  Voltage: 6.3V  Dielectric: X5R  [CAPC0201]
C?#138  value 0.22uF  Case/Package: 0201  Voltage: 6.3V  Dielectric: X5R  [CAPC0201]
C?#139  value 0.22uF  Case/Package: 0201  Voltage: 6.3V  Dielectric: X5R  [CAPC0201]
C?#140  value 0.22uF  Case/Package: 0201  Voltage: 6.3V  Dielectric: X5R  [CAPC0201]
C?#141  value 0.22uF  Case/Package: 0201  Voltage: 6.3V  Dielectric: X5R  [CAPC0201]
C?#142  value 0.22uF  Case/Package: 0201  Voltage: 6.3V  Dielectric: X5R  [CAPC0201]
C?#143  value 0.22uF  Case/Package: 0201  Voltage: 6.3V  Dielectric: X5R  [CAPC0201]
C?#144  value 0.22uF  Case/Package: 0201  Voltage: 6.3V  Dielectric: X5R  [CAPC0201]
C?#145  value 0.22uF  Case/Package: 0201  Voltage: 6.3V  Dielectric: X5R  [CAPC0201]
C?#146  value 0.22uF  Case/Package: 0201  Voltage: 6.3V  Dielectric: X5R  [CAPC0201]
C?#147  value 0.22uF  Case/Package: 0201  Voltage: 6.3V  Dielectric: X5R  [CAPC0201]
C?#148  value 100nF  Case/Package: 0402  Voltage: 25V  Dielectric: X5R  [CAPC0402]
J?#5  PCIe_GEN5
R?#247  value 10K  Case/Package: 0402  [RESC0402]  (hidden comment: Res)
R?#248  value 10K  Case/Package: 0402  [RESC0402]  (hidden comment: Res)
R?#249  value 10K  Case/Package: 0402  [RESC0402]  (hidden comment: Res)
R?#250  value 10K  Case/Package: 0402  [RESC0402]  (hidden comment: Res)
R?#251  value 10K  Case/Package: 0402  [RESC0402]  (hidden comment: Res)
R?#252  value 0E  Case/Package: 0402  [RESC0402]  (hidden comment: Res)
R?#253  value 10K  Case/Package: 0402  [RESC0402]  (hidden comment: Res)
R?#254  value 0E  Case/Package: 0402  [RESC0402]  (hidden comment: Res)
R?#255  value 2.2K  Case/Package: 0402  [RESC0402]  (hidden comment: Res)
R?#256  value 2.2K  Case/Package: 0402  [RESC0402]  (hidden comment: Res)
R?#257  value 10K  Case/Package: 0402  [RESC0402]  (hidden comment: Res)
R?#258  value 0E  Case/Package: 0402  [RESC0402]  (hidden comment: Res)
R?#259  value 0E  Case/Package: 0402  [RESC0402]  (hidden comment: Res)
R?#260  value 100K  Case/Package: 0402  [RESC0402]  (hidden comment: Res)
R?#261  value 0E  Case/Package: 0402  [RESC0402]  (hidden comment: Res)
R?#262  value 0E  Case/Package: 0402  [RESC0402]  (hidden comment: Res)
R?#263  value 0E  Case/Package: 0402  [RESC0402]  (hidden comment: Res)
R?#264  value 0E  Case/Package: 0402  [RESC0402]  (hidden comment: Res)
R?#265  value 0E  Case/Package: 0402  [RESC0402]  (hidden comment: Res)
R?#266  value 100K  Case/Package: 0402  [RESC0402]  (hidden comment: Res)
R?#267  value 0E  Case/Package: 0402  [RESC0402]  (hidden comment: Res)
R?#268  value 0E  Case/Package: 0402  [RESC0402]  (hidden comment: Res)
R?#269  value 0E  Case/Package: 0402  [RESC0402]  (hidden comment: Res)
R?#270  value 0E  Case/Package: 0402  [RESC0402]  (hidden comment: Res)
R?#271  value 0E  Case/Package: 0402  [RESC0402]  (hidden comment: Res)
R?#272  value 0E  Case/Package: 0402  [RESC0402]  (hidden comment: Res)
R?#273  value 0E  Case/Package: 0402  [RESC0402]  (hidden comment: Res)
R?#274  value 10K  Case/Package: 0402  [RESC0402]  (hidden comment: Res)
R?#275  value 0E  Case/Package: 0402  [RESC0402]  (hidden comment: Res)
R?#276  value 0E  Case/Package: 0402  [RESC0402]  (hidden comment: Res)
R?#277  value 0E  Case/Package: 0402  [RESC0402]  (hidden comment: Res)
SW?#1  DHN-04F-T-V

### Ports
CLK_SRC_PEG_SLOT_DN, CLK_SRC_PEG_SLOT_DP, DG2_I2C_SCL_R, DG2_PECI_SW, DG2_PRESENT, DG_PLI_SW, EXP_A_RX_0_DN (out), EXP_A_RX_0_DP (out), EXP_A_RX_1_DN (out), EXP_A_RX_1_DP (out), EXP_A_RX_2_DN (out), EXP_A_RX_2_DP (out), EXP_A_RX_3_DN (out), EXP_A_RX_3_DP (out), EXP_A_RX_4_DN (out), EXP_A_RX_4_DP (out), EXP_A_RX_5_DN (out), EXP_A_RX_5_DP (out), EXP_A_RX_6_DN (out), EXP_A_RX_6_DP (out), EXP_A_RX_7_DN (out), EXP_A_RX_7_DP (out), EXP_A_RX_8_DN (out), EXP_A_RX_8_DP (out), EXP_A_RX_9_DN (out), EXP_A_RX_9_DP (out), EXP_A_RX_10_DN (out), EXP_A_RX_10_DP (out), EXP_A_RX_11_DN (out), EXP_A_RX_11_DP (out), EXP_A_RX_12_DN (out), EXP_A_RX_12_DP (out), EXP_A_RX_13_DN (out), EXP_A_RX_13_DP (out), EXP_A_RX_14_DN (out), EXP_A_RX_14_DP (out), EXP_A_RX_15_DN (out), EXP_A_RX_15_DP (out), EXP_A_TX_0_DN (in), EXP_A_TX_0_DP (in), EXP_A_TX_1_DN (in), EXP_A_TX_1_DP (in), EXP_A_TX_2_DN (in), EXP_A_TX_2_DP (in), EXP_A_TX_3_DN (in), EXP_A_TX_3_DP (in), EXP_A_TX_4_DN (in), EXP_A_TX_4_DP (in), EXP_A_TX_5_DN (in), EXP_A_TX_5_DP (in), EXP_A_TX_6_DN (in), EXP_A_TX_6_DP (in), EXP_A_TX_7_DN (in), EXP_A_TX_7_DP (in), EXP_A_TX_8_DN (in), EXP_A_TX_8_DP (in), EXP_A_TX_9_DN (in), EXP_A_TX_9_DP (in), EXP_A_TX_10_DN (in), EXP_A_TX_10_DP (in), EXP_A_TX_11_DN (in), EXP_A_TX_11_DP (in), EXP_A_TX_12_DN (in), EXP_A_TX_12_DP (in), EXP_A_TX_13_DN (in), EXP_A_TX_13_DP (in), EXP_A_TX_14_DN (in), EXP_A_TX_14_DP (in), EXP_A_TX_15_DN (in), EXP_A_TX_15_DP (in), GPP_C_0_SMBCLK, GPP_C_1_SMBDATA, GPP_E_4_SATA_DEVSLP_0, GPP_E_6_SATA_DEVSLP_2, GPP_E_12_USB2_OCB_3_GMII_MDIO_1, GPP_E_15_SPI1_MISO_IO_1_THC0_SPI1_IO_1, GPP_K_3_GSXSRESET_N, H_PROCHOT_DG2_N, H_THRMTRIP_N_SW, I2C_SDA_R, PCH_THERMTRIP_N, PCH_WAKE_N, PEG_PIM_DG2, PEG_PLI_N_DG2, PEG_RTD3_COLD_MOD_SW, PEG_SLOT_DGPU_SEL_N, PEG_SLOT_RST_N, SMB_CLK_RESUME, SMB_DATA_RESUME, SRCCLKREQ_PEG_SLOT_N, USB2_OC_VRT1_N

### Nets
+V3P3A: R?#257.2
+V3P3A_PCIEAUX: C?#125.1 C?#126.1 J?#5.B10(3V3_AUX)
+V3P3S: R?#247.2 R?#249.2 R?#250.2 R?#251.2
+V3P3S_PEG_SLOT: C?#117.1 C?#118.1 C?#123.1(+) J?#5.A9(3V3_2) J?#5.A10(3V3_3) J?#5.B8(3V3_1) R?#248.2 R?#255.2 R?#256.2
+V12S_PEG_SLOT: C?#103.1(+) C?#104.1(+) C?#105.1(+) C?#106.1(+) C?#107.1(+) C?#108.1 C?#109.1 C?#110.1 J?#5.A2(12V_3) J?#5.A3(12V_4) J?#5.B1(12V_1) J?#5.B2(12V_2) J?#5.B3(12V_5)
+VCCPGPPEFK_3P3_1P8_R: R?#274.2
EXP_A_RX_4_DP: C?#103.2 C?#104.2 C?#105.2 C?#106.2 C?#107.2 C?#108.2 C?#109.2 C?#110.2 C?#117.2 C?#118.2 C?#123.2 C?#125.2 C?#126.2 C?#148.1 J?#5.165(MTG1) J?#5.166(MTG2) J?#5.A4(GND0) J?#5.A12(GND3) J?#5.A15(GND5) J?#5.A18(GND7) J?#5.A20(GND9) J?#5.A23(GND12) J?#5.A24(GND13) J?#5.A27(GND16) J?#5.A28(GND17) J?#5.A31(GND19) J?#5.A34(GND21) J?#5.A35(PERP4) J?#5.A37(GND24) J?#5.A38(GND25) J?#5.A39(PERP5) J?#5.A41(GND28) J?#5.A42(GND29) J?#5.A45(GND32) J?#5.A46(GND33) J?#5.A49(GND35) J?#5.A51(GND37) J?#5.A54(GND40) J?#5.A55(GND41) J?#5.A58(GND44) J?#5.A59(GND45) J?#5.A62(GND48) J?#5.A63(GND49) J?#5.A66(GND52) J?#5.A67(GND53) J?#5.A70(GND56) J?#5.A71(GND57) J?#5.A74(GND60) J?#5.A75(GND61) J?#5.A78(GND64) J?#5.A79(GND65) J?#5.A82(GND67) J?#5.B4(GND1) J?#5.B7(GND2) J?#5.B13(GND4) J?#5.B16(GND6) J?#5.B18(GND8) J?#5.B21(GND10) J?#5.B22(GND11) J?#5.B25(GND14) J?#5.B26(GND15) J?#5.B29(GND18) J?#5.B32(GND20) J?#5.B35(GND22) J?#5.B36(GND23) J?#5.B39(GND26) J?#5.B40(GND27) J?#5.B43(GND30) J?#5.B44(GND31) J?#5.B47(GND34) J?#5.B49(GND36) J?#5.B52(GND38) J?#5.B53(GND39) J?#5.B56(GND42) J?#5.B57(GND43) J?#5.B60(GND46) J?#5.B61(GND47) J?#5.B64(GND50) J?#5.B65(GND51) J?#5.B68(GND54) J?#5.B69(GND55) J?#5.B72(GND58) J?#5.B73(GND59) J?#5.B76(GND62) J?#5.B77(GND63) J?#5.B80(GND66) R?#252.1 R?#253.1 R?#260.1 R?#266.2 SW?#1.4(S4) ; port EXP_A_RX_4_DP, port EXP_A_RX_5_DP  [also labelled EXP_A_RX_5_DP, GND]
CLK_SRC_PEG_SLOT_DN: J?#5.A14(REFCLKN) ; port CLK_SRC_PEG_SLOT_DN
CLK_SRC_PEG_SLOT_DP: J?#5.A13(REFCLKP) ; port CLK_SRC_PEG_SLOT_DP
DG2_I2C_INT: R?#261.1 R?#277.2
DG2_I2C_INT_R: J?#5.B82(RSVD7) R?#261.2
DG2_I2C_SCL_R: J?#5.A50(RSVD8) R?#259.1 R?#259.2 ; port DG2_I2C_SCL_R
DG2_I2C_SDA_R: J?#5.A33(RSVD6) R?#258.1
DG2_PECI_SW: J?#5.A6(TDI) R?#276.1 R?#276.2 ; port DG2_PECI_SW
DG2_PRESENT: J?#5.B48(~{3PRSNT2}) R?#260.2 SW?#1.3(S3) ; port DG2_PRESENT
DG2_PRESENT_SW: SW?#1.6
DG_PLI_SW: J?#5.A8(TMS) R?#272.2 ; port DG_PLI_SW
EXP_A_RX_0_DN: J?#5.A17(PERN0) ; port EXP_A_RX_0_DN
EXP_A_RX_0_DP: J?#5.A16(PERP0) ; port EXP_A_RX_0_DP
EXP_A_RX_1_DN: J?#5.A22(PERN1) ; port EXP_A_RX_1_DN
EXP_A_RX_1_DP: J?#5.A21(PERP1) ; port EXP_A_RX_1_DP
EXP_A_RX_2_DN: J?#5.A26(PERN2) ; port EXP_A_RX_2_DN
EXP_A_RX_2_DP: J?#5.A25(PERP2) ; port EXP_A_RX_2_DP
EXP_A_RX_3_DN: J?#5.A30(PERN3) ; port EXP_A_RX_3_DN
EXP_A_RX_3_DP: J?#5.A29(PERP3) ; port EXP_A_RX_3_DP
EXP_A_RX_4_DN: J?#5.A36(PERN4) ; port EXP_A_RX_4_DN
EXP_A_RX_5_DN: J?#5.A40(PERN5) ; port EXP_A_RX_5_DN
EXP_A_RX_6_DN: J?#5.A44(PERN6) ; port EXP_A_RX_6_DN
EXP_A_RX_6_DP: J?#5.A43(PERP6) ; port EXP_A_RX_6_DP
EXP_A_RX_7_DN: J?#5.A48(PERN7) ; port EXP_A_RX_7_DN
EXP_A_RX_7_DP: J?#5.A47(PERP7) ; port EXP_A_RX_7_DP
EXP_A_RX_8_DN: J?#5.A53(PERN8) ; port EXP_A_RX_8_DN
EXP_A_RX_8_DP: J?#5.A52(PERP8) ; port EXP_A_RX_8_DP
EXP_A_RX_9_DN: J?#5.A57(PERN9) ; port EXP_A_RX_9_DN
EXP_A_RX_9_DP: J?#5.A56(PERP9) ; port EXP_A_RX_9_DP
EXP_A_RX_10_DN: J?#5.A61(PERN10) ; port EXP_A_RX_10_DN
EXP_A_RX_10_DP: J?#5.A60(PERP10) ; port EXP_A_RX_10_DP
EXP_A_RX_11_DN: J?#5.A65(PERN11) ; port EXP_A_RX_11_DN
EXP_A_RX_11_DP: J?#5.A64(PERP11) ; port EXP_A_RX_11_DP
EXP_A_RX_12_DN: J?#5.A69(PERN12) ; port EXP_A_RX_12_DN
EXP_A_RX_12_DP: J?#5.A68(PERP12) ; port EXP_A_RX_12_DP
EXP_A_RX_13_DN: J?#5.A73(PERN13) ; port EXP_A_RX_13_DN
EXP_A_RX_13_DP: J?#5.A72(PERP13) ; port EXP_A_RX_13_DP
EXP_A_RX_14_DN: J?#5.A77(PERN14) ; port EXP_A_RX_14_DN
EXP_A_RX_14_DP: J?#5.A76(PERP14) ; port EXP_A_RX_14_DP
EXP_A_RX_15_DN: J?#5.A81(PERN15) ; port EXP_A_RX_15_DN
EXP_A_RX_15_DP: J?#5.A80(PERP15) ; port EXP_A_RX_15_DP
EXP_A_TX_0_C_DN: C?#112.2 J?#5.B15(PETN0)
EXP_A_TX_0_C_DP: C?#111.2 J?#5.B14(PETP0)
EXP_A_TX_0_DN: C?#112.1 ; port EXP_A_TX_0_DN
EXP_A_TX_0_DP: C?#111.1 ; port EXP_A_TX_0_DP
EXP_A_TX_1_C_DN: C?#114.2 J?#5.B20(PETN1)
EXP_A_TX_1_C_DP: C?#113.2 J?#5.B19(PETP1)
EXP_A_TX_1_DN: C?#114.1 ; port EXP_A_TX_1_DN
EXP_A_TX_1_DP: C?#113.1 ; port EXP_A_TX_1_DP
EXP_A_TX_2_DN: C?#116.1 C?#116.2 J?#5.B24(PETN2) ; port EXP_A_TX_2_DN
EXP_A_TX_2_DP: C?#115.1 C?#115.2 J?#5.B23(PETP2) ; port EXP_A_TX_2_DP
EXP_A_TX_3_C_DN: C?#120.2 J?#5.B28(PETN3)
EXP_A_TX_3_C_DP: C?#119.2 J?#5.B27(PETP3)
EXP_A_TX_3_DN: C?#120.1 ; port EXP_A_TX_3_DN
EXP_A_TX_3_DP: C?#119.1 ; port EXP_A_TX_3_DP
EXP_A_TX_4_C_DN: C?#122.2 J?#5.B34(PETN4)
EXP_A_TX_4_C_DP: C?#121.2 J?#5.B33(PETP4)
EXP_A_TX_4_DN: C?#122.1 ; port EXP_A_TX_4_DN
EXP_A_TX_4_DP: C?#121.1 ; port EXP_A_TX_4_DP
EXP_A_TX_5_C_DN: C?#127.2 J?#5.B38(PETN5)
EXP_A_TX_5_C_DP: C?#124.2 J?#5.B37(PETP5)
EXP_A_TX_5_DN: C?#127.1 ; port EXP_A_TX_5_DN
EXP_A_TX_5_DP: C?#124.1 ; port EXP_A_TX_5_DP
EXP_A_TX_6_C_DN: C?#129.2 J?#5.B42(PETN6)
EXP_A_TX_6_C_DP: C?#128.2 J?#5.B41(PETP6)
EXP_A_TX_6_DN: C?#129.1 ; port EXP_A_TX_6_DN
EXP_A_TX_6_DP: C?#128.1 ; port EXP_A_TX_6_DP
EXP_A_TX_7_C_DN: C?#131.2 J?#5.B46(PETN7)
EXP_A_TX_7_C_DP: C?#130.2 J?#5.B45(PETP7)
EXP_A_TX_7_DN: C?#131.1 ; port EXP_A_TX_7_DN
EXP_A_TX_7_DP: C?#130.1 ; port EXP_A_TX_7_DP
EXP_A_TX_8_C_DN: C?#133.2 J?#5.B51(PETN8)
EXP_A_TX_8_C_DP: C?#132.2 J?#5.B50(PETP8)
EXP_A_TX_8_DN: C?#133.1 ; port EXP_A_TX_8_DN
EXP_A_TX_8_DP: C?#132.1 ; port EXP_A_TX_8_DP
EXP_A_TX_9_C_DN: C?#135.2 J?#5.B55(PETN9)
EXP_A_TX_9_C_DP: C?#134.2 J?#5.B54(PETP9)
EXP_A_TX_9_DN: C?#135.1 ; port EXP_A_TX_9_DN
EXP_A_TX_9_DP: C?#134.1 ; port EXP_A_TX_9_DP
EXP_A_TX_10_C_DN: C?#137.2 J?#5.B59(PETN10)
EXP_A_TX_10_C_DP: C?#136.2 J?#5.B58(PETP10)
EXP_A_TX_10_DN: C?#137.1 ; port EXP_A_TX_10_DN
EXP_A_TX_10_DP: C?#136.1 ; port EXP_A_TX_10_DP
EXP_A_TX_11_C_DN: C?#139.2 J?#5.B63(PETN11)
EXP_A_TX_11_C_DP: C?#138.2 J?#5.B62(PETP11)
EXP_A_TX_11_DN: C?#139.1 ; port EXP_A_TX_11_DN
EXP_A_TX_11_DP: C?#138.1 ; port EXP_A_TX_11_DP
EXP_A_TX_12_C_DN: C?#141.2 J?#5.B67(PETN12)
EXP_A_TX_12_C_DP: C?#140.2 J?#5.B66(PETP12)
EXP_A_TX_12_DN: C?#141.1 ; port EXP_A_TX_12_DN
EXP_A_TX_12_DP: C?#140.1 ; port EXP_A_TX_12_DP
EXP_A_TX_13_C_DN: C?#143.2 J?#5.B71(PETN13)
EXP_A_TX_13_C_DP: C?#142.2 J?#5.B70(PETP13)
EXP_A_TX_13_DN: C?#143.1 ; port EXP_A_TX_13_DN
EXP_A_TX_13_DP: C?#142.1 ; port EXP_A_TX_13_DP
EXP_A_TX_14_C_DN: C?#145.2 J?#5.B75(PETN14)
EXP_A_TX_14_C_DP: C?#144.2 J?#5.B74(PETP14)
EXP_A_TX_14_DN: C?#145.1 ; port EXP_A_TX_14_DN
EXP_A_TX_14_DP: C?#144.1 ; port EXP_A_TX_14_DP
EXP_A_TX_15_C_DN: C?#147.2 J?#5.B79(PETN15)
EXP_A_TX_15_C_DP: C?#146.2 J?#5.B78(PETP15)
EXP_A_TX_15_DN: C?#147.1 ; port EXP_A_TX_15_DN
EXP_A_TX_15_DP: C?#146.1 ; port EXP_A_TX_15_DP
GPP_C_0_SMBCLK: R?#262.1 ; port GPP_C_0_SMBCLK
GPP_C_1_SMBDATA: R?#263.1 ; port GPP_C_1_SMBDATA
GPP_E_4_SATA_DEVSLP_0: R?#264.1 ; port GPP_E_4_SATA_DEVSLP_0
GPP_E_6_SATA_DEVSLP_2: R?#265.1 ; port GPP_E_6_SATA_DEVSLP_2
GPP_E_12_USB2_OCB_3_GMII_MDIO_1: C?#148.2 R?#274.1 R?#275.1 R?#277.1 ; port GPP_E_12_USB2_OCB_3_GMII_MDIO_1
GPP_E_15_SPI1_MISO_IO_1_THC0_SPI1_IO_1: R?#271.1 ; port GPP_E_15_SPI1_MISO_IO_1_THC0_SPI1_IO_1
GPP_K_3_GSXSRESET_N: R?#269.1 ; port GPP_K_3_GSXSRESET_N
H_PROCHOT_DG2_N: R?#270.1 ; port H_PROCHOT_DG2_N
H_THRMTRIP_N_SW: J?#5.A5(TCK) R?#273.2 ; port H_THRMTRIP_N_SW
I2C_SDA_R: R?#258.2 ; port I2C_SDA_R
PCH_THERMTRIP_N: R?#273.1 ; port PCH_THERMTRIP_N
PCH_WAKE_N: R?#254.1 ; port PCH_WAKE_N
PCIEX16_PRSNT2_N: J?#5.B17(~{PRSNT2}) J?#5.B31(~{2PRSNT2}) J?#5.B81(~{4PRSNT2}) SW?#1.7 ; port SRCCLKREQ_PEG_SLOT_N  [also labelled SRCCLKREQ_PEG_SLOT_N]
PCIEX16_PRSNT2_R_N: SW?#1.1(S1) SW?#1.2(S2)
PEG_PIM_DG2: R?#267.1 ; port PEG_PIM_DG2
PEG_PIM_DG2_SW: J?#5.B9(TRST) R?#267.2
PEG_PLI_N_DG2: R?#272.1 ; port PEG_PLI_N_DG2
PEG_RTD3_COLD_MOD_SW: J?#5.A7(TDO) R?#247.1 R?#248.1 R?#253.2 R?#271.2 ; port PEG_RTD3_COLD_MOD_SW
PEG_SLOT_A19: J?#5.A19(RSVD4) R?#257.1 R?#269.2
PEG_SLOT_A32: J?#5.A32(RSVD5) R?#264.2 R?#266.1
PEG_SLOT_B12: J?#5.B12(RSVD2) SW?#1.8
PEG_SLOT_B30: J?#5.B30(RSVD3) R?#268.2 R?#270.2
PEG_SLOT_DGPU_SEL_N: R?#268.1 ; port PEG_SLOT_DGPU_SEL_N
PEG_SLOT_RST_N: J?#5.A11(~{PERST}) R?#249.1 ; port PEG_SLOT_RST_N
PEG_SLOT_WAKE_N: J?#5.B11(~{WAKE}) R?#250.1 R?#251.1 R?#254.2 R?#265.2
SMB_CLK_RESUME: J?#5.B5(SMCLK) R?#255.1 R?#262.2 ; port SMB_CLK_RESUME
SMB_DATA_RESUME: J?#5.B6(SMDAT) R?#256.1 R?#263.2 ; port SMB_DATA_RESUME
USB2_OC_VRT1_N: R?#275.2 ; port USB2_OC_VRT1_N
VIRTUAL_BATTERY: SW?#1.5
NetJ?#5_A1: J?#5.A1(~{PRSNT1}) R?#252.2

### Notes on the sheet
- incomplete
- DESIGN NOTE:
- DGPU_PWR_OK FOR PEG PWROK FUNCTION
- REMOVE EMI CAP IF
- ROUTING IS STRIPLINE ONLY
- (near R?#277) CAD NOTE:
- (near R?#277) PLACE 100nF <3cm FROM PCH
- (in symbol PCIe_GEN5) MECH KEY; END OF X1; END OF X4; END OF X8

### Library data of the parts
C?#103-C?#107 C?#123 = cap_polar: CAP CER 100uF 25V; Manufacturer Part Number: *; Case/Package: *; Dielectric: *
C?#108-C?#110 C?#117 C?#118 C?#125 C?#126 = Cap: CAP CER 0.1uF 50V X7R 0603
C?#111-C?#116 C?#119-C?#122 C?#124 C?#127-C?#147 = Cap: CAP CER 0.22uF 6.3V X5R 0201
C?#148 = Cap: CAP CER 100nF 25V X5R 0402; DNP: DNP
R?#247 R?#248 R?#253 R?#257 R?#274 = Res: Thick Film Resistor -  10Kohm, 1%, 0402
  R?#247 R?#248 R?#253 R?#257: DNP: DNP
R?#249-R?#251 = Res: Thick Film Resistor - 10Kohm, 1%, 0402
  R?#249 R?#251: DNP: DNP
R?#252 R?#254 R?#258 R?#259 R?#261-R?#265 R?#267-R?#273 R?#275-R?#277 = Res: Thick Film Resistor -  0ohm, 1%, 0402
  R?#254 R?#258 R?#259 R?#261 R?#267 R?#268 R?#271 R?#277: DNP: DNP
R?#255 R?#256 = Res: Thick Film Resistor - 2.2Kohm, 1%, 0402; DNP: DNP
R?#260 = Res: Thick Film Resistor - 100Kohm, 1%, 0402
R?#266 = Res: Thick Film Resistor -  100Kohm, 1%, 0402

## Sheet 0053_PCIE GEN5_MISC.SchDoc
size A3
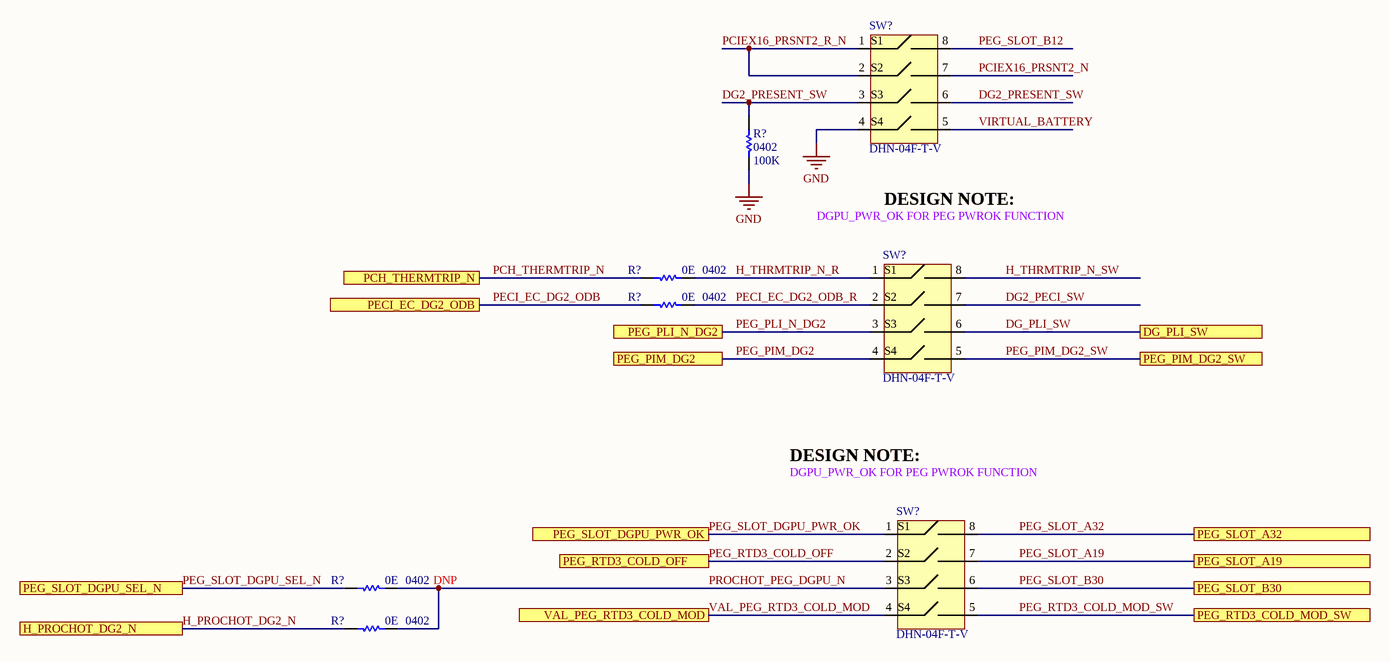
[diagram p82: 0053_PCIE GEN5_MISC.SchDoc]

### Parts
(Parts that share a designator on the sheet are numbered #1, #2 ... from top to bottom, then left to right.)
R?#278  value 100K  Case/Package: 0402  [RESC0402]  (hidden comment: Res)
R?#279  value 0E  Case/Package: 0402  [RESC0402]  (hidden comment: Res)
R?#280  value 0E  Case/Package: 0402  [RESC0402]  (hidden comment: Res)
R?#281  value 0E  Case/Package: 0402  [RESC0402]  (hidden comment: Res)
R?#282  value 0E  Case/Package: 0402  [RESC0402]  (hidden comment: Res)
SW?#2  DHN-04F-T-V
SW?#3  DHN-04F-T-V
SW?#4  DHN-04F-T-V

### Ports
DG_PLI_SW, H_PROCHOT_DG2_N, PCH_THERMTRIP_N, PECI_EC_DG2_ODB, PEG_PIM_DG2, PEG_PIM_DG2_SW, PEG_PLI_N_DG2, PEG_RTD3_COLD_MOD_SW, PEG_RTD3_COLD_OFF, PEG_SLOT_A19, PEG_SLOT_A32, PEG_SLOT_B30, PEG_SLOT_DGPU_PWR_OK, PEG_SLOT_DGPU_SEL_N, VAL_PEG_RTD3_COLD_MOD

### Nets
GND: R?#278.1 SW?#2.4(S4)  [project net EXP_A_RX_4_DP]
DG2_PECI_SW: SW?#3.7
DG2_PRESENT_SW: R?#278.2 SW?#2.3(S3) SW?#2.6
DG_PLI_SW: SW?#3.6 ; port DG_PLI_SW
H_PROCHOT_DG2_N: R?#282.1 ; port H_PROCHOT_DG2_N
H_THRMTRIP_N_R: R?#279.2 SW?#3.1(S1)
H_THRMTRIP_N_SW: SW?#3.8
PCH_THERMTRIP_N: R?#279.1 ; port PCH_THERMTRIP_N
PCIEX16_PRSNT2_N: SW?#2.7
PCIEX16_PRSNT2_R_N: SW?#2.1(S1) SW?#2.2(S2)
PECI_EC_DG2_ODB: R?#280.1 ; port PECI_EC_DG2_ODB
PECI_EC_DG2_ODB_R: R?#280.2 SW?#3.2(S2)
PEG_PIM_DG2: SW?#3.4(S4) ; port PEG_PIM_DG2
PEG_PIM_DG2_SW: SW?#3.5 ; port PEG_PIM_DG2_SW
PEG_PLI_N_DG2: SW?#3.3(S3) ; port PEG_PLI_N_DG2
PEG_RTD3_COLD_MOD_SW: SW?#4.5 ; port PEG_RTD3_COLD_MOD_SW
PEG_RTD3_COLD_OFF: SW?#4.2(S2) ; port PEG_RTD3_COLD_OFF
PEG_SLOT_A19: SW?#4.7 ; port PEG_SLOT_A19
PEG_SLOT_A32: SW?#4.8 ; port PEG_SLOT_A32
PEG_SLOT_B12: SW?#2.8
PEG_SLOT_B30: SW?#4.6 ; port PEG_SLOT_B30
PEG_SLOT_DGPU_PWR_OK: SW?#4.1(S1) ; port PEG_SLOT_DGPU_PWR_OK
PEG_SLOT_DGPU_SEL_N: R?#281.1 ; port PEG_SLOT_DGPU_SEL_N
PROCHOT_PEG_DGPU_N: R?#281.2 R?#282.2 SW?#4.3(S3)
VAL_PEG_RTD3_COLD_MOD: SW?#4.4(S4) ; port VAL_PEG_RTD3_COLD_MOD
VIRTUAL_BATTERY: SW?#2.5

### Notes on the sheet
- DESIGN NOTE:
- DGPU_PWR_OK FOR PEG PWROK FUNCTION

### Library data of the parts
R?#278 = Res: Thick Film Resistor - 100Kohm, 1%, 0402
R?#279-R?#282 = Res: Thick Film Resistor -  0ohm, 1%, 0402
  R?#281: DNP: DNP

## Sheet 0054_eDP_CONNECTOR.SchDoc
size A3
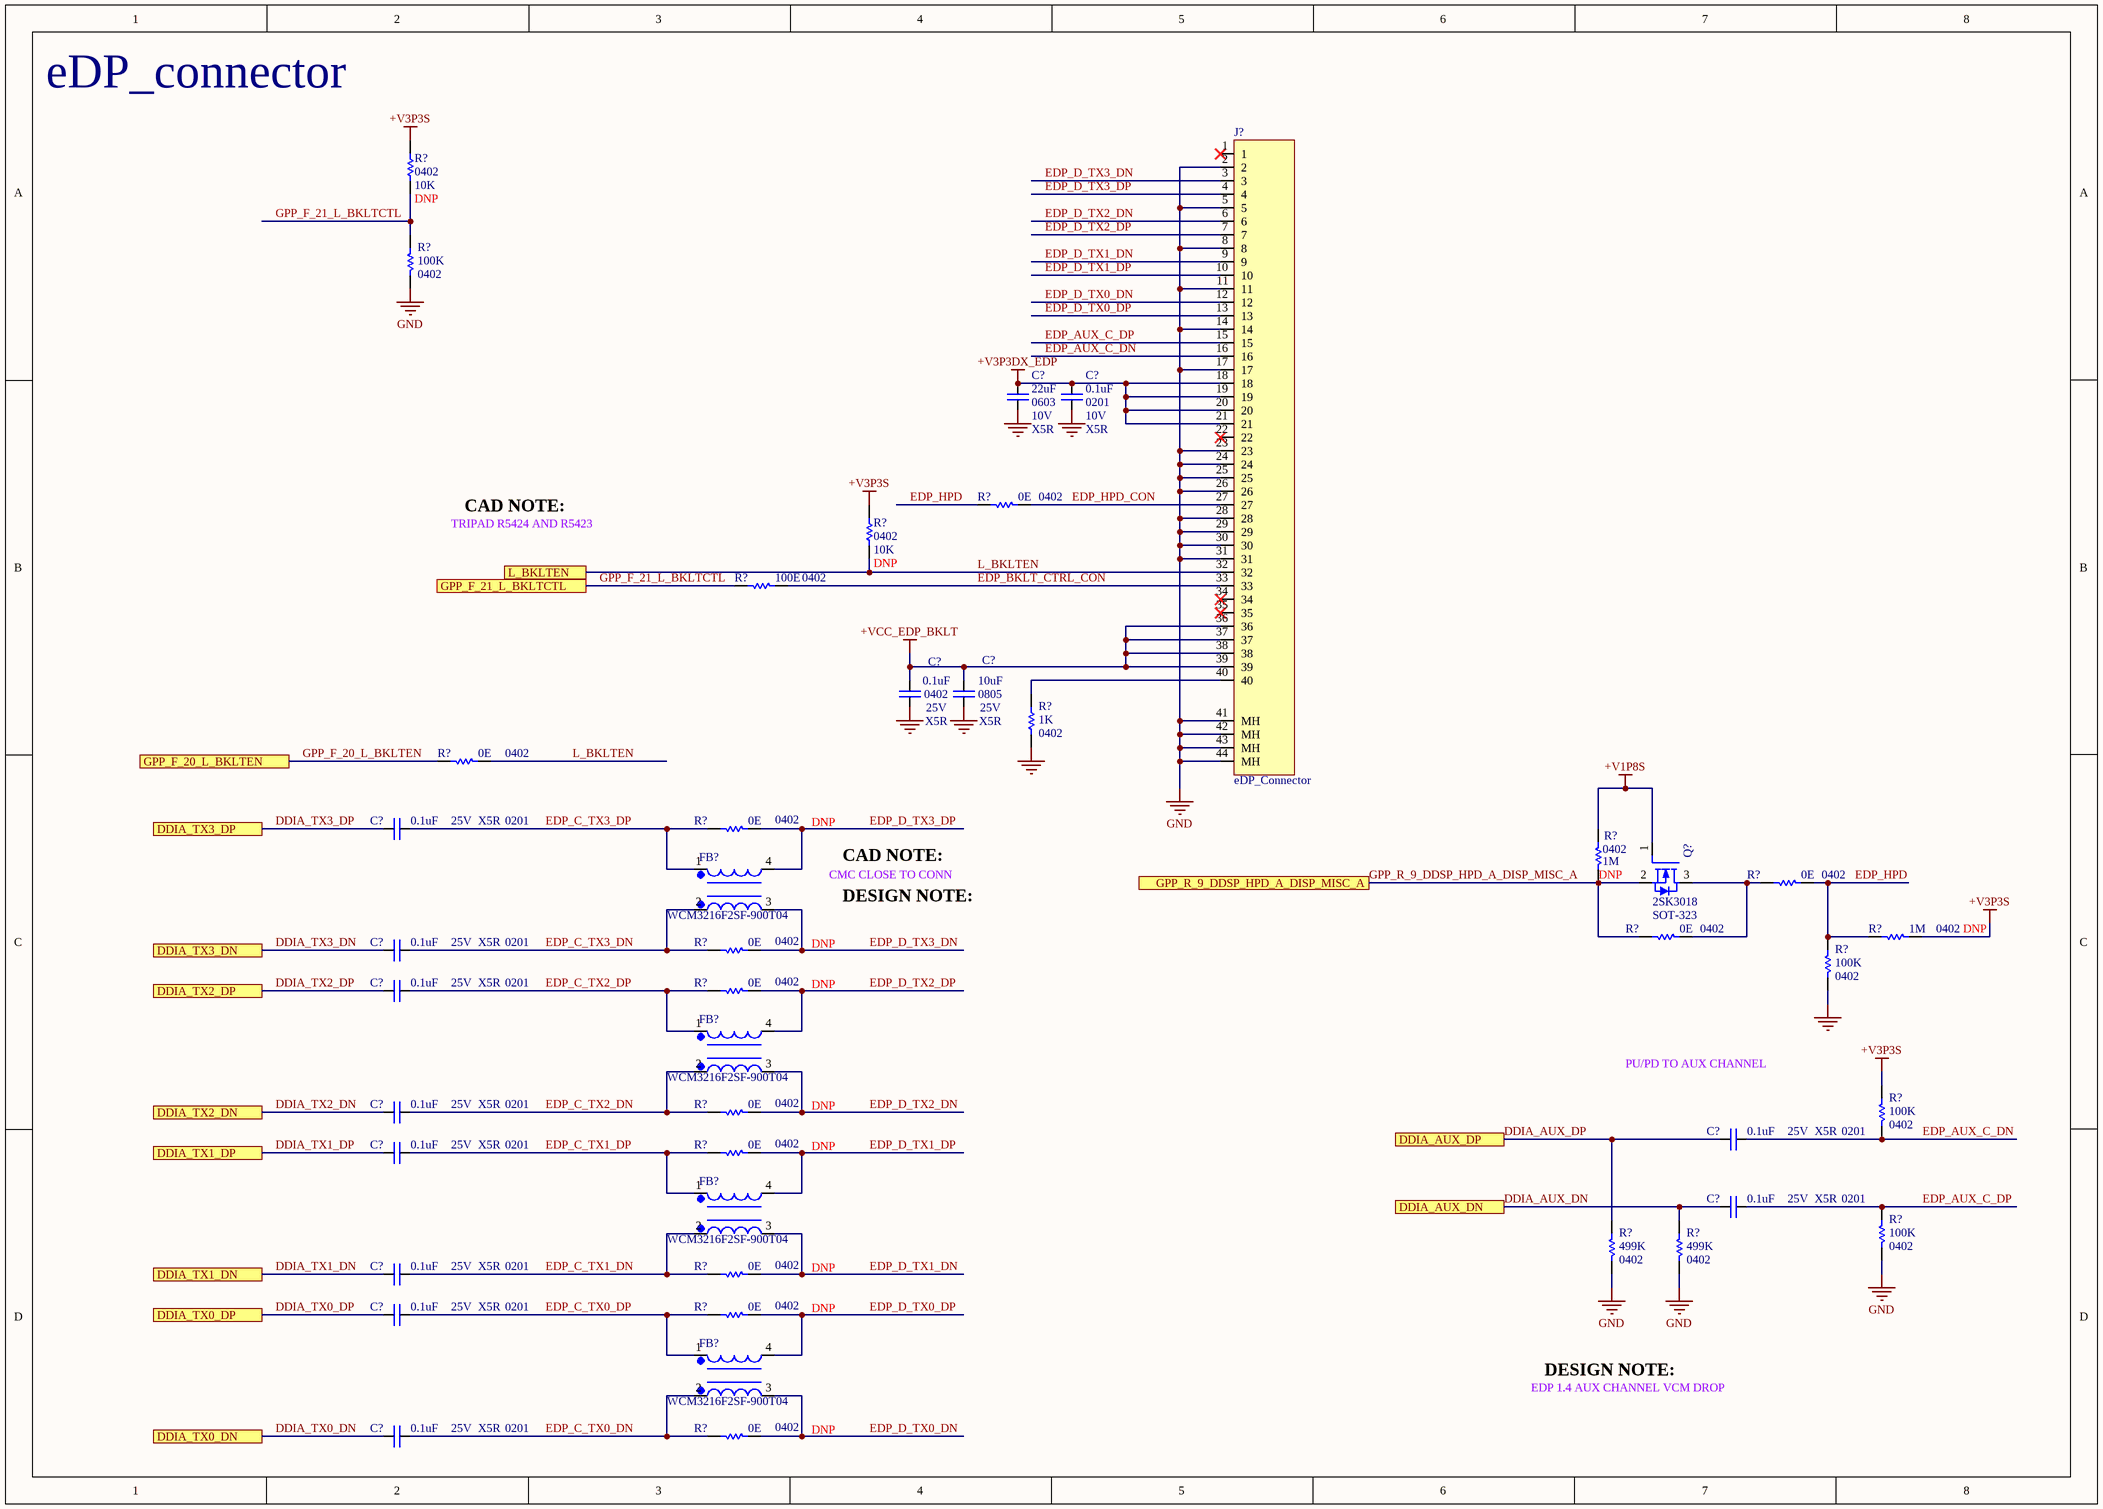
[diagram p83: 0054_eDP_CONNECTOR.SchDoc]

### Parts
(Parts that share a designator on the sheet are numbered #1, #2 ... from top to bottom, then left to right.)
C?#149  value 22uF  Case/Package: 0603  Voltage: 10V  Dielectric: X5R  [CAPC0603]
C?#150  value 0.1uF  Case/Package: 0201  Voltage: 10V  Dielectric: X5R  [CAPC0201]
C?#151  value 0.1uF  Case/Package: 0402  Voltage: 25V  Dielectric: X5R  [CAPC0402]
C?#152  value 10uF  Case/Package: 0805  Voltage: 25V  Dielectric: X5R  [CAPC0805]
C?#153  value 0.1uF  Case/Package: 0201  Voltage: 25V  Dielectric: X5R  [CAPC0201]
C?#154  value 0.1uF  Case/Package: 0201  Voltage: 25V  Dielectric: X5R  [CAPC0201]
C?#155  value 0.1uF  Case/Package: 0201  Voltage: 25V  Dielectric: X5R  [CAPC0201]
C?#156  value 0.1uF  Case/Package: 0201  Voltage: 25V  Dielectric: X5R  [CAPC0201]
C?#157  value 0.1uF  Case/Package: 0201  Voltage: 25V  Dielectric: X5R  [CAPC0201]
C?#158  value 0.1uF  Case/Package: 0201  Voltage: 25V  Dielectric: X5R  [CAPC0201]
C?#159  value 0.1uF  Case/Package: 0201  Voltage: 25V  Dielectric: X5R  [CAPC0201]
C?#160  value 0.1uF  Case/Package: 0201  Voltage: 25V  Dielectric: X5R  [CAPC0201]
C?#161  value 0.1uF  Case/Package: 0201  Voltage: 25V  Dielectric: X5R  [CAPC0201]
C?#162  value 0.1uF  Case/Package: 0201  Voltage: 25V  Dielectric: X5R  [CAPC0201]
FB?#2  WCM3216F2SF-900T04  [CHOKE]
FB?#3  WCM3216F2SF-900T04  [CHOKE]
FB?#4  WCM3216F2SF-900T04  [CHOKE]
FB?#5  WCM3216F2SF-900T04  [CHOKE]
J?#6  eDP_Connector
Q?#1  Manufacturer Part Number: 2SK3018  Case/Package: SOT-323  [SOT323]  (hidden comment: MOSFET N_2SK3018)
R?#283  value 10K  Case/Package: 0402  [RESC0402]  (hidden comment: Res)
R?#284  value 100K  Case/Package: 0402  [RESC0402]  (hidden comment: Res)
R?#285  value 0E  Case/Package: 0402  [RESC0402]  (hidden comment: Res)
R?#286  value 10K  Case/Package: 0402  [RESC0402]  (hidden comment: Res)
R?#287  value 100E  Case/Package: 0402  [RESC0402]  (hidden comment: Res)
R?#288  value 1K  Case/Package: 0402  [RESC0402]  (hidden comment: Res)
R?#289  value 0E  Case/Package: 0402  [RESC0402]  (hidden comment: Res)
R?#290  value 0E  Case/Package: 0402  [RESC0402]  (hidden comment: Res)
R?#291  value 1M  Case/Package: 0402  [RESC0402]  (hidden comment: Res)
R?#292  value 0E  Case/Package: 0402  [RESC0402]  (hidden comment: Res)
R?#293  value 0E  Case/Package: 0402  [RESC0402]  (hidden comment: Res)
R?#294  value 1M  Case/Package: 0402  [RESC0402]  (hidden comment: Res)
R?#295  value 0E  Case/Package: 0402  [RESC0402]  (hidden comment: Res)
R?#296  value 100K  Case/Package: 0402  [RESC0402]  (hidden comment: Res)
R?#297  value 0E  Case/Package: 0402  [RESC0402]  (hidden comment: Res)
R?#298  value 0E  Case/Package: 0402  [RESC0402]  (hidden comment: Res)
R?#299  value 100K  Case/Package: 0402  [RESC0402]  (hidden comment: Res)
R?#300  value 0E  Case/Package: 0402  [RESC0402]  (hidden comment: Res)
R?#301  value 100K  Case/Package: 0402  [RESC0402]  (hidden comment: Res)
R?#302  value 499K  Case/Package: 0402  [RESC0402]  (hidden comment: Res)
R?#303  value 499K  Case/Package: 0402  [RESC0402]  (hidden comment: Res)
R?#304  value 0E  Case/Package: 0402  [RESC0402]  (hidden comment: Res)
R?#305  value 0E  Case/Package: 0402  [RESC0402]  (hidden comment: Res)
R?#306  value 0E  Case/Package: 0402  [RESC0402]  (hidden comment: Res)

### Ports
DDIA_AUX_DN, DDIA_AUX_DP, DDIA_TX0_DN, DDIA_TX0_DP, DDIA_TX1_DN, DDIA_TX1_DP, DDIA_TX2_DN, DDIA_TX2_DP, DDIA_TX3_DN, DDIA_TX3_DP, GPP_F_20_L_BKLTEN, GPP_F_21_L_BKLTCTL, GPP_R_9_DDSP_HPD_A_DISP_MISC_A, L_BKLTEN

### Nets
+V1P8S: Q?#1.1(GATE) R?#291.2
+V3P3DX_EDP: C?#149.2 C?#150.2 J?#6.18 J?#6.19 J?#6.20 J?#6.21
+V3P3S: R?#283.2 R?#286.2 R?#294.1 R?#299.2
+VCC_EDP_BKLT: C?#151.2 C?#152.2 J?#6.36 J?#6.37 J?#6.38 J?#6.39
GND: C?#149.1 C?#150.1 C?#151.1 C?#152.1 J?#6.2 J?#6.5 J?#6.8 J?#6.11 J?#6.14 J?#6.17 J?#6.23 J?#6.24 J?#6.25 J?#6.26 J?#6.28 J?#6.29 J?#6.30 J?#6.31 J?#6.41(MH) J?#6.42(MH) J?#6.43(MH) J?#6.44(MH) R?#284.1 R?#288.1 R?#296.1 R?#301.1 R?#302.1 R?#303.1  [project net EXP_A_RX_4_DP]
DDIA_AUX_DN: C?#159.2 R?#303.2 ; port DDIA_AUX_DN
DDIA_AUX_DP: C?#157.2 R?#302.2 ; port DDIA_AUX_DP
DDIA_TX0_DN: C?#162.2 ; port DDIA_TX0_DN
DDIA_TX0_DP: C?#161.2 ; port DDIA_TX0_DP
DDIA_TX1_DN: C?#160.2 ; port DDIA_TX1_DN
DDIA_TX1_DP: C?#158.2 ; port DDIA_TX1_DP
DDIA_TX2_DN: C?#156.2 ; port DDIA_TX2_DN
DDIA_TX2_DP: C?#155.2 ; port DDIA_TX2_DP
DDIA_TX3_DN: C?#154.2 ; port DDIA_TX3_DN
DDIA_TX3_DP: C?#153.2 ; port DDIA_TX3_DP
EDP_AUX_C_DN: C?#157.1 J?#6.16 R?#299.1
EDP_AUX_C_DP: C?#159.1 J?#6.15 R?#301.2
EDP_BKLT_CTRL_CON: J?#6.33 R?#287.2
EDP_C_TX0_DN: C?#162.1 FB?#5.2 R?#306.1
EDP_C_TX0_DP: C?#161.1 FB?#5.1 R?#305.1
EDP_C_TX1_DN: C?#160.1 FB?#4.2 R?#304.1
EDP_C_TX1_DP: C?#158.1 FB?#4.1 R?#300.1
EDP_C_TX2_DN: C?#156.1 FB?#3.2 R?#298.1
EDP_C_TX2_DP: C?#155.1 FB?#3.1 R?#297.1
EDP_C_TX3_DN: C?#154.1 FB?#2.2 R?#295.1
EDP_C_TX3_DP: C?#153.1 FB?#2.1 R?#290.1
EDP_D_TX0_DN: FB?#5.3 J?#6.12 R?#306.2
EDP_D_TX0_DP: FB?#5.4 J?#6.13 R?#305.2
EDP_D_TX1_DN: FB?#4.3 J?#6.9 R?#304.2
EDP_D_TX1_DP: FB?#4.4 J?#6.10 R?#300.2
EDP_D_TX2_DN: FB?#3.3 J?#6.6 R?#298.2
EDP_D_TX2_DP: FB?#3.4 J?#6.7 R?#297.2
EDP_D_TX3_DN: FB?#2.3 J?#6.3 R?#295.2
EDP_D_TX3_DP: FB?#2.4 J?#6.4 R?#290.2
EDP_HPD: R?#285.1 R?#292.2 R?#294.2 R?#296.2
EDP_HPD_CON: J?#6.27 R?#285.2
GPP_F_20_L_BKLTEN: R?#289.1 ; port GPP_F_20_L_BKLTEN
GPP_F_21_L_BKLTCTL: R?#283.1 R?#284.2 R?#287.1 ; port GPP_F_21_L_BKLTCTL
GPP_R_9_DDSP_HPD_A_DISP_MISC_A: Q?#1.2(SOURCE) R?#291.1 R?#293.1 ; port GPP_R_9_DDSP_HPD_A_DISP_MISC_A
L_BKLTEN: J?#6.32 R?#286.1 R?#289.2 ; port L_BKLTEN
NetJ?#6_40: J?#6.40 R?#288.2
NetQ?#1_3: Q?#1.3(DRAIN) R?#292.1 R?#293.2

Not connected (* = marked no-connect by the designer): J?#6 1* 22* 34* 35*

### Notes on the sheet
- eDP_connector
- CAD NOTE:
- TRIPAD R5424 AND R5423
- CMC CLOSE TO CONN
- DESIGN NOTE:
- PU/PD TO AUX CHANNEL
- EDP 1.4 AUX CHANNEL VCM DROP

### Library data of the parts
C?#149 = Cap: CAP CER 22uF 10V X5R 0603
C?#150 = Cap: CAP CER 0.1uF 10V X5R 0201
C?#151 = Cap: CAP CER 0.1uF 25V X5R 0402
C?#152 = Cap: CAP CER 10uF 25V X5R 0805
C?#153-C?#162 = Cap: CAP CER 0.1uF 25V X5R 0201
FB?#2-FB?#5 = WCM3216F2SF-900T04: Power, Signal Line 90 Ohms @ 100MHz 300 mOhm 50V SMD,3.2x1.6x2mm Common Mode Filters RoHS; Manufacturer Part Number: WCM3216F2SF-900T04; Case/Package: 3.2x1.6x2mm
Q?#1 = MOSFET N_2SK3018: NMOS,2SK3018,SOT_323,Id=0.1A,Vds=30V
R?#283 R?#286 = Res: Thick Film Resistor -  10Kohm, 1%, 0402; DNP: DNP
R?#284 R?#296 R?#299 R?#301 = Res: Thick Film Resistor -  100Kohm, 1%, 0402
R?#285 R?#289 R?#290 R?#292 R?#293 R?#295 R?#297 R?#298 R?#300 R?#304-R?#306 = Res: Thick Film Resistor -  0ohm, 1%, 0402
  R?#290 R?#295 R?#297 R?#298 R?#300 R?#304-R?#306: DNP: DNP
R?#287 = Res: Thick Film Resistor - 100ohm, 1%, 0402
R?#288 = Res: Thick Film Resistor -  1Kohm, 1%, 0402
R?#291 R?#294 = Res: Thick Film Resistor -  1MOhm, 1%, 0402; DNP: DNP
R?#302 R?#303 = Res: Thick Film Resistor -  499Kohm, 1%, 0402

## Sheet 0055_LED CON.SchDoc
size 848 x 558 mm
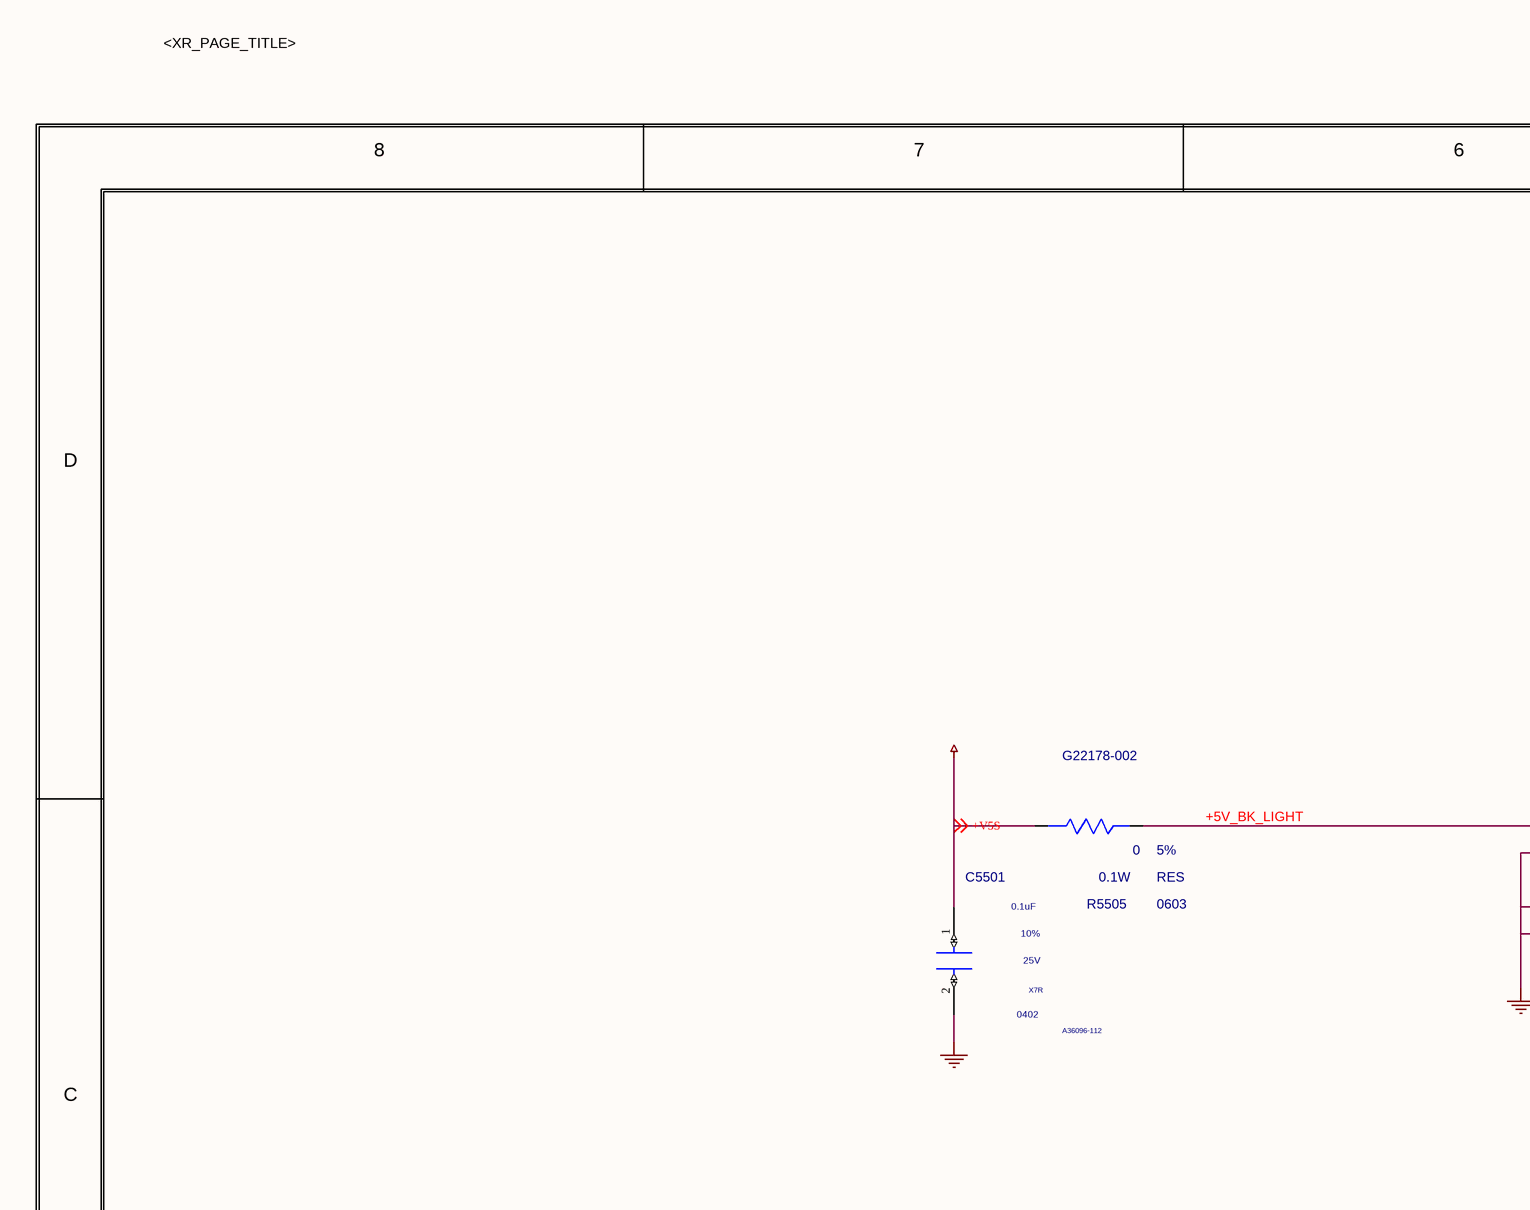
[diagram p84: 0055_LED CON.SchDoc, top left]
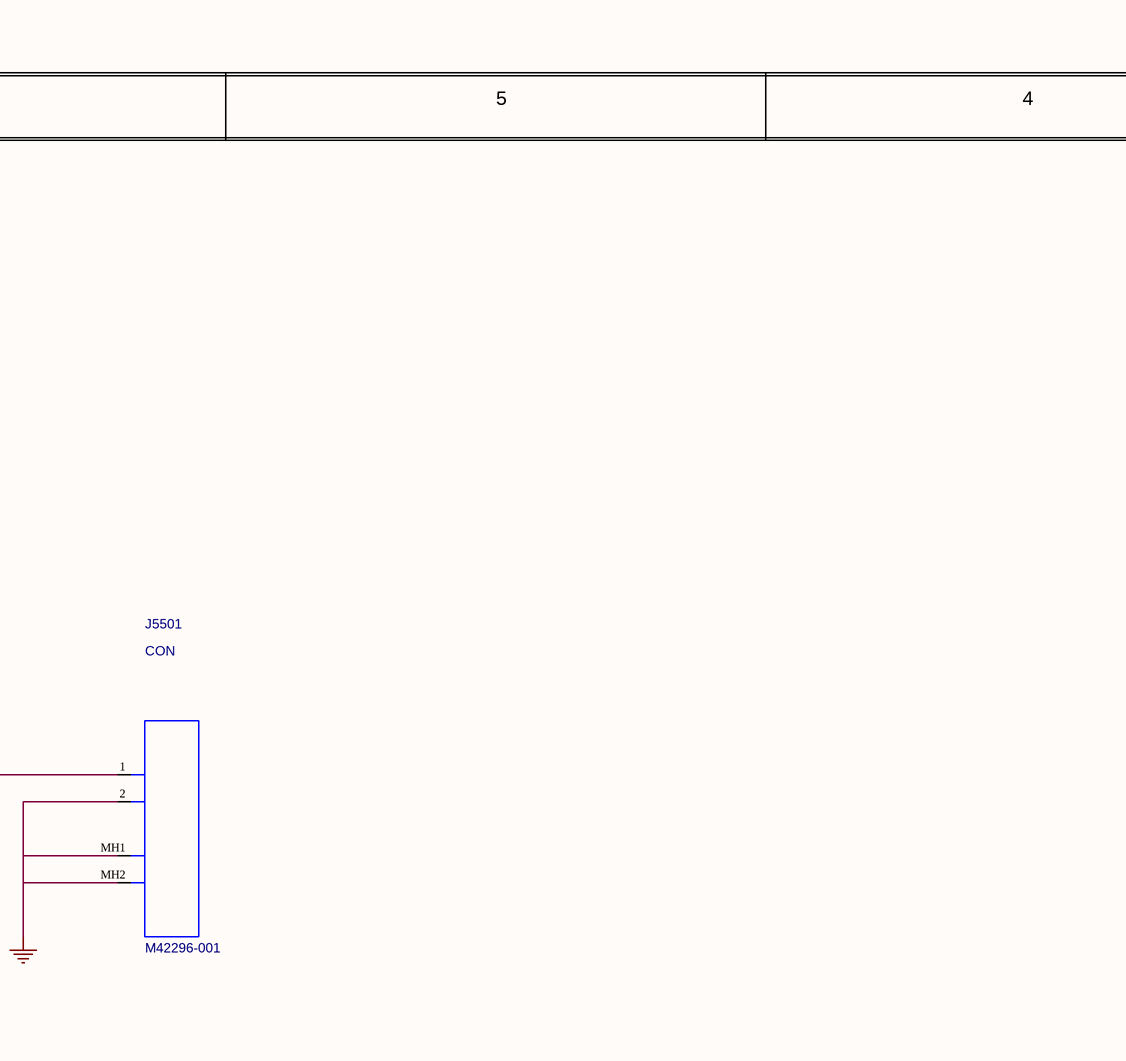
[diagram p85: 0055_LED CON.SchDoc, top middle]
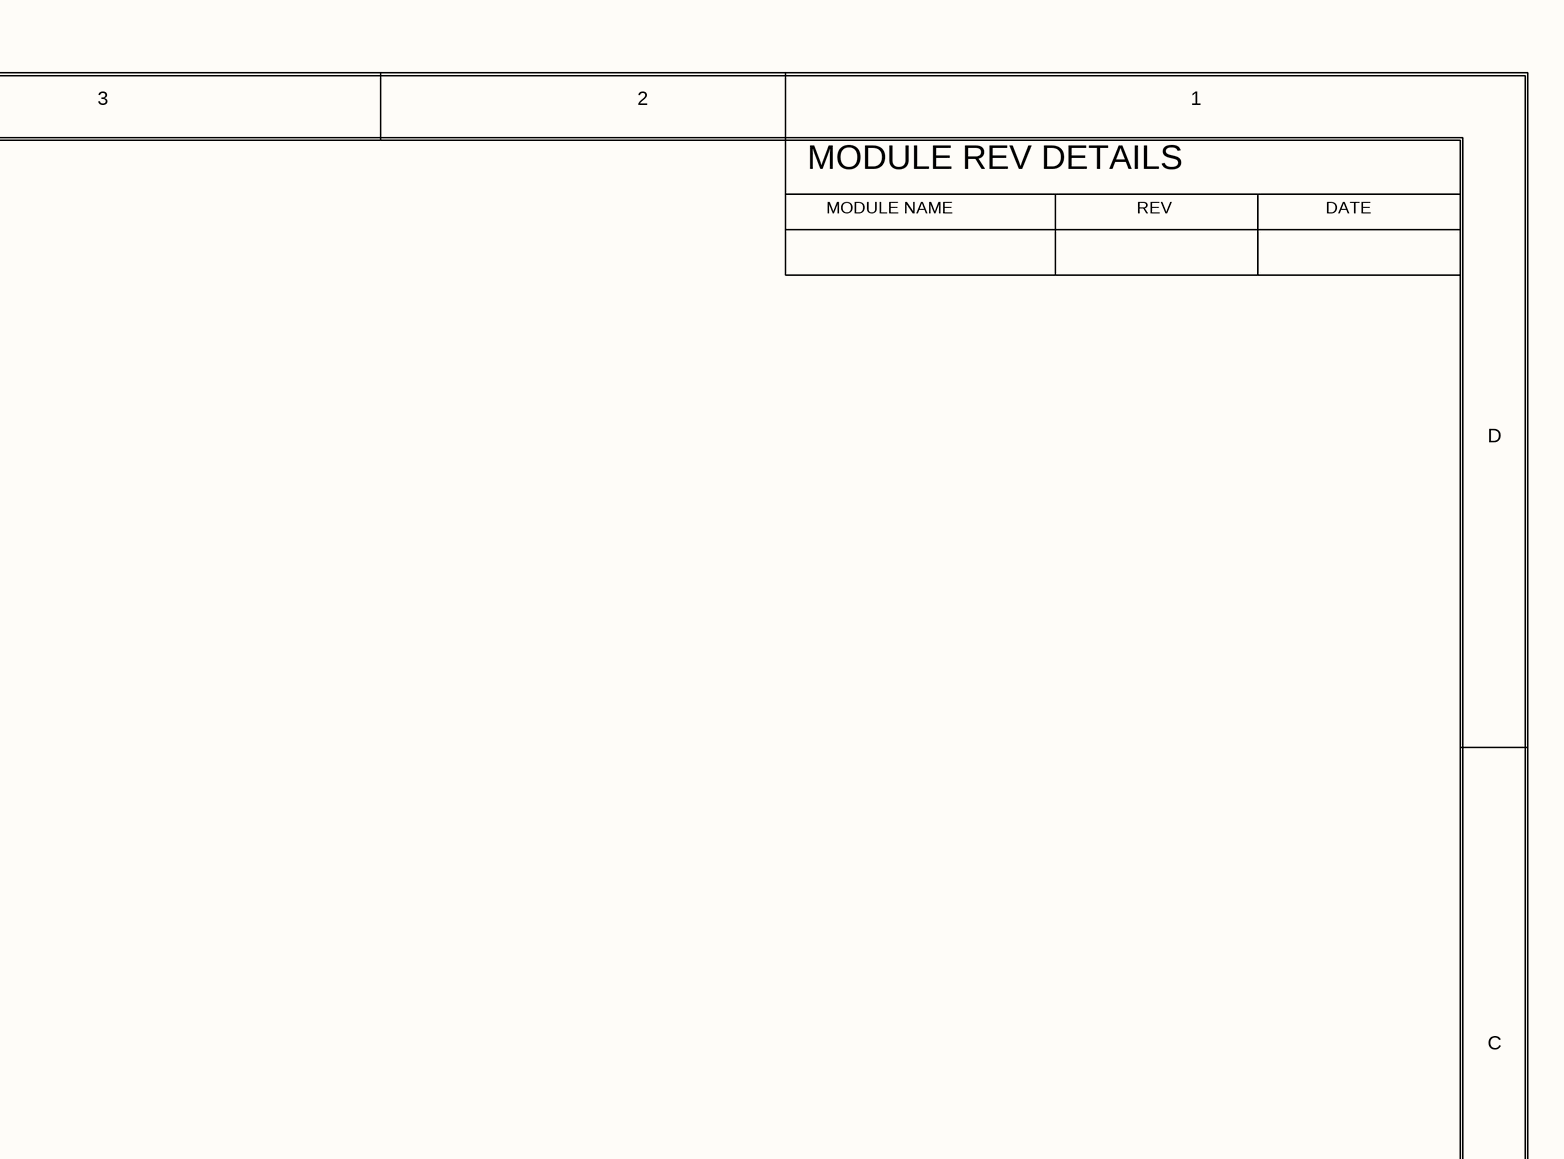
[diagram p86: 0055_LED CON.SchDoc, top right]
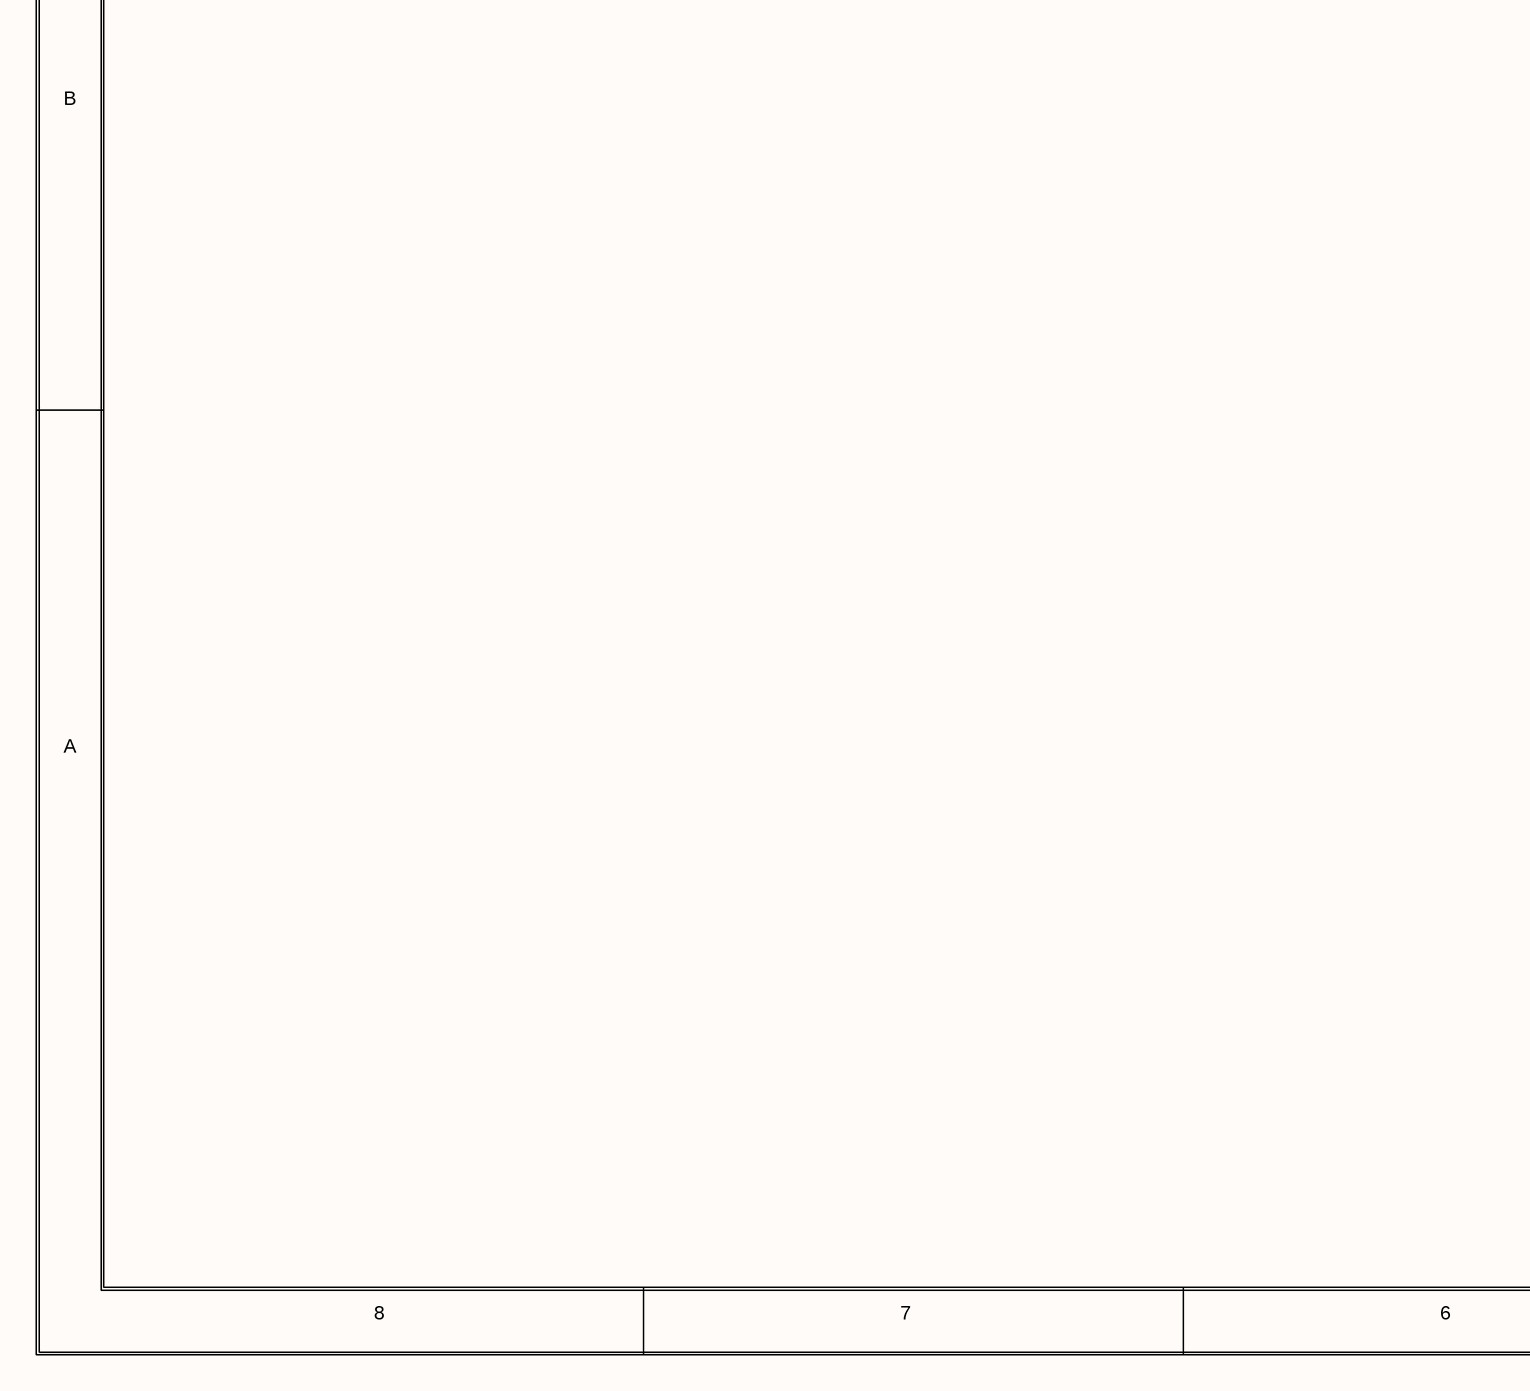
[diagram p87: 0055_LED CON.SchDoc, bottom left]
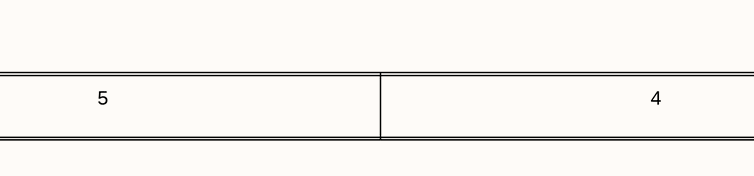
[diagram p88: 0055_LED CON.SchDoc, bottom middle]
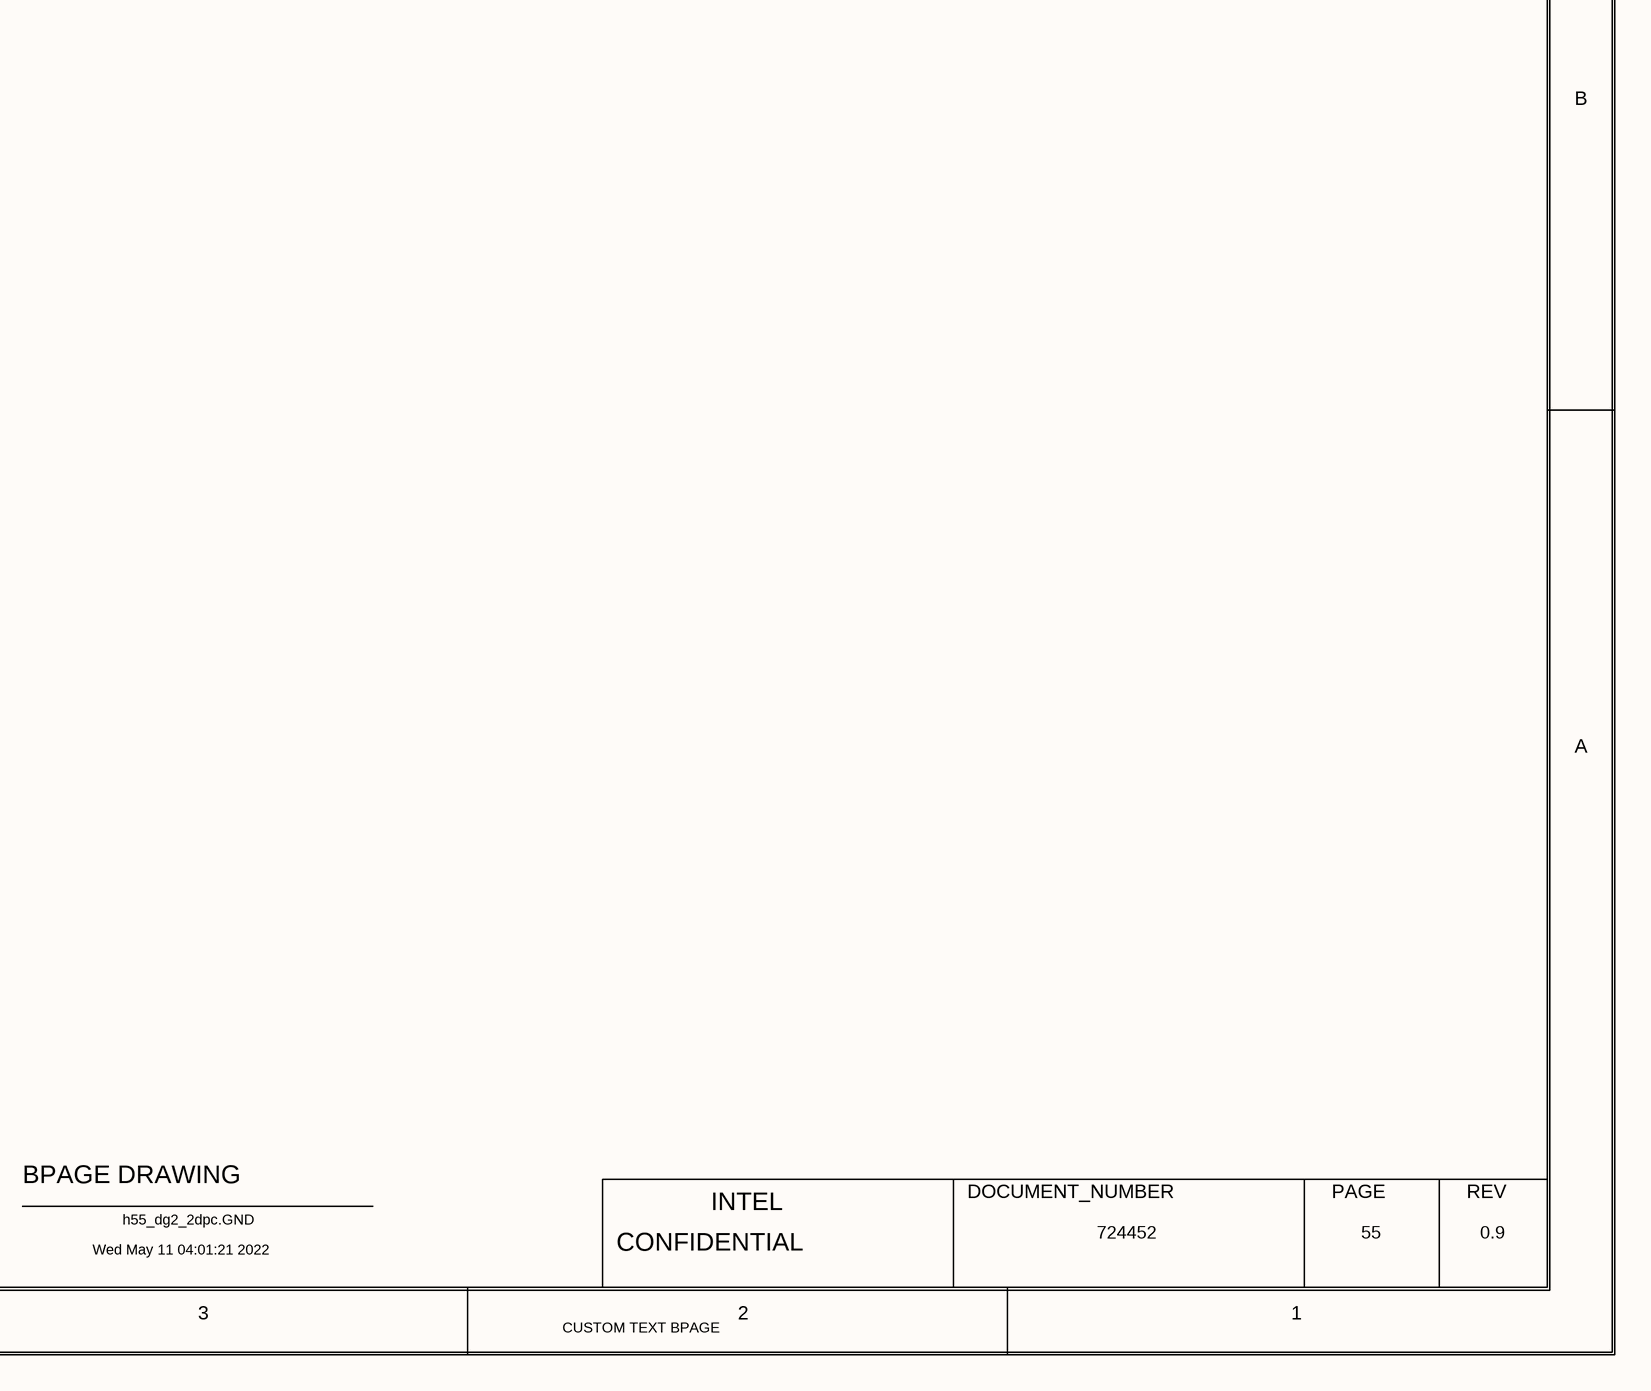
[diagram p89: 0055_LED CON.SchDoc, bottom right]

### Parts
C5501  0.1uF  MATERIAL: X7R  PACK_TYPE: 0402  PART_NUMBER: A36096-112  TOLERANCE: 10%  VOLTAGE: 25V  [SMC0402IA]
J5501  MATERIAL: CON  PART_NUMBER: M42296-001  [CTK0_B2B_SPR_1X2_2EM_1000_MA_VR]  (hidden comment: C_B2B_1X2_2EM)
R5505  0  MATERIAL: RES  PACK_TYPE: 0603  PART_NUMBER: G22178-002  TOLERANCE: 5%  WATTAGE: 0.1W  [CTK0_SM0603_1700X950_MA]

### Nets
+V5S: C5501.1(A) R5505.1(A) ; off-sheet +V5S
GND: C5501.2(B) J5501.2(IO2) J5501.MH1 J5501.MH2  [project net EXP_A_RX_4_DP]
+5V_BK_LIGHT: J5501.1(IO1) R5505.2(B)

### Notes on the sheet
- <XR_PAGE_TITLE>
- 8
- 7
- 6
- 5
- 4
- 3
- 2
- 1
- MODULE REV DETAILS
- MODULE NAME
- REV
- DATE
- D
- C
- B
- A
- BPAGE DRAWING
- INTEL
- DOCUMENT_NUMBER
- PAGE
- Wed May 11 04:01:21 2022
- h55_dg2_2dpc.GND
- CONFIDENTIAL
- 724452
- 55
- 0.9
- CUSTOM TEXT BPAGE

### Library data of the parts
C5501 = CAP: CDS_PHYS_PART_NAME: CAP_0402-A36096-112,X7R,0.1UF,25V,10%,LPDB,GENERIC; OriginalSymbolOrigin: (-50,25); XY: (-6850,3950); VER: 1; ROT: 2; PHYS_PAGE: 55; LOCATION: C5501; IP: GENERIC; FP_TECH: LPDB; DRAWING: @RVP1_ADL_SB_ADP_S_DDR5_SODIMM_2DPC_LIB.H55_DG2_2DPC(SCH_1):PAGE55; CDS_LIB: discrete; PCB Footprint: SMC0402IA; CHIPS_PART_NAME: CAP; CDS_PART_NAME: CAP_0402-A36096-112,X7R,0.1UF,25V,10%,LPDB,GENERIC; CDS_LOCATION: C5501; ASI_MODEL: A36096-112
J5501 = C_B2B_1X2_2EM: CDS_PHYS_PART_NAME: C_B2B_1X2_2EM_SM-M42296-001,CON,B2B_1X2_2EM,TK0,GENERIC; CDS_LMAN_SYM_OUTLINE: -50,200,50,-200; FP_TECH: TK0; IP: GENERIC; PACK_TYPE: SM; ROOM: NONE; OriginalSymbolOrigin: (-75,200); XY: (-5525,4100); VER: 1; ROT: 0; PHYS_PAGE: 55; LOCATION: J5501; DRAWING: @RVP1_ADL_SB_ADP_S_DDR5_SODIMM_2DPC_LIB.H55_DG2_2DPC(SCH_1):PAGE55; CDS_LIB: local; VARIANT: ?; PCB Footprint: CTK0_B2B_SPR_1X2_2EM_1000_MA_VR; SEC_TYPE: SM; CHIPS_PART_NAME: C_B2B_1X2_2EM; CDS_PART_NAME: C_B2B_1X2_2EM_SM-M42296-001,CON,B2B_1X2_2EM,TK0,GENERIC; CDS_LOCATION: J5501
R5505 = C_RES#1: CHIPS_PART_NAME: C_RES; CDS_PHYS_PART_NAME: C_RES_0603-G22178-002,RES,0,5%,0.1W,TK0,GENERIC; CDS_LMAN_SYM_OUTLINE: -50,50,50,-50; FP_TECH: TK0; IP: GENERIC; ROOM: NONE; OriginalSymbolOrigin: (-75,25); XY: (-6600,4200); VER: 1; PHYS_PAGE: 55; LOCATION: R5505; DRAWING: @RVP1_ADL_SB_ADP_S_DDR5_SODIMM_2DPC_LIB.H55_DG2_2DPC(SCH_1):PAGE55; CDS_LIB: c_discrete; VARIANT: ?; PCB Footprint: CTK0_SM0603_1700X950_MA; ROT: 0; CDS_PART_NAME: C_RES_0603-G22178-002,RES,0,5%,0.1W,TK0,GENERIC; CDS_LOCATION: R5505